# Altium project DSP_FPGA_BOTTOM.PrjPcb (part 2 of 2)

## Sheet Enconder_Part3.SchDoc
size A4
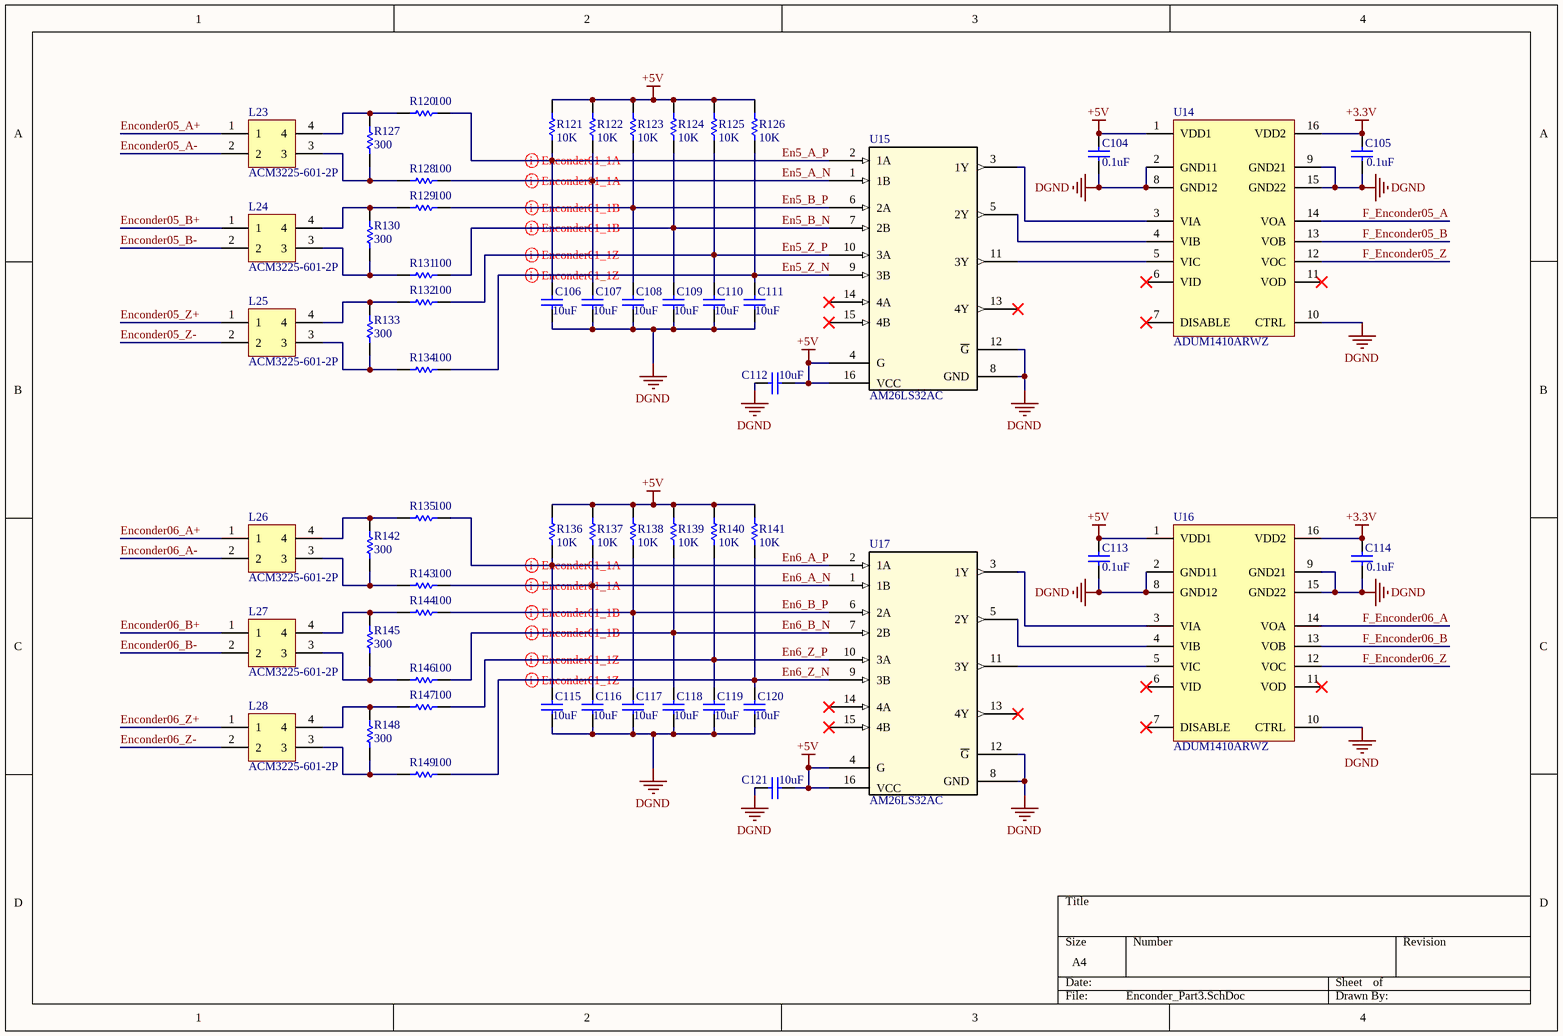
[diagram p10: Enconder_Part3.SchDoc]

### Parts
C104  value 0.1uF  [1608[0603]]  (hidden comment: Cap)
C105  value 0.1uF  [1608[0603]]  (hidden comment: Cap)
C106  value 10uF  [1608[0603]]  (hidden comment: Cap)
C107  value 10uF  [1608[0603]]  (hidden comment: Cap)
C108  value 10uF  [1608[0603]]  (hidden comment: Cap)
C109  value 10uF  [1608[0603]]  (hidden comment: Cap)
C110  value 10uF  [1608[0603]]  (hidden comment: Cap)
C111  value 10uF  [1608[0603]]  (hidden comment: Cap)
C112  value 10uF  [1608[0603]]  (hidden comment: Cap)
C113  value 0.1uF  [1608[0603]]  (hidden comment: Cap)
C114  value 0.1uF  [1608[0603]]  (hidden comment: Cap)
C115  value 10uF  [1608[0603]]  (hidden comment: Cap)
C116  value 10uF  [1608[0603]]  (hidden comment: Cap)
C117  value 10uF  [1608[0603]]  (hidden comment: Cap)
C118  value 10uF  [1608[0603]]  (hidden comment: Cap)
C119  value 10uF  [1608[0603]]  (hidden comment: Cap)
C120  value 10uF  [1608[0603]]  (hidden comment: Cap)
C121  value 10uF  [1608[0603]]  (hidden comment: Cap)
L23  ACM3225-601-2P  [ACM3225-601-2P]
L24  ACM3225-601-2P  [ACM3225-601-2P]
L25  ACM3225-601-2P  [ACM3225-601-2P]
L26  ACM3225-601-2P  [ACM3225-601-2P]
L27  ACM3225-601-2P  [ACM3225-601-2P]
L28  ACM3225-601-2P  [ACM3225-601-2P]
R120  value 100  [1608[0603]]  (hidden comment: Res1)
R121  value 10K  [1608[0603]]  (hidden comment: Res1)
R122  value 10K  [1608[0603]]  (hidden comment: Res1)
R123  value 10K  [1608[0603]]  (hidden comment: Res1)
R124  value 10K  [1608[0603]]  (hidden comment: Res1)
R125  value 10K  [1608[0603]]  (hidden comment: Res1)
R126  value 10K  [1608[0603]]  (hidden comment: Res1)
R127  value 300  [1608[0603]]  (hidden comment: Res1)
R128  value 100  [1608[0603]]  (hidden comment: Res1)
R129  value 100  [1608[0603]]  (hidden comment: Res1)
R130  value 300  [1608[0603]]  (hidden comment: Res1)
R131  value 100  [1608[0603]]  (hidden comment: Res1)
R132  value 100  [1608[0603]]  (hidden comment: Res1)
R133  value 300  [1608[0603]]  (hidden comment: Res1)
R134  value 100  [1608[0603]]  (hidden comment: Res1)
R135  value 100  [1608[0603]]  (hidden comment: Res1)
R136  value 10K  [1608[0603]]  (hidden comment: Res1)
R137  value 10K  [1608[0603]]  (hidden comment: Res1)
R138  value 10K  [1608[0603]]  (hidden comment: Res1)
R139  value 10K  [1608[0603]]  (hidden comment: Res1)
R140  value 10K  [1608[0603]]  (hidden comment: Res1)
R141  value 10K  [1608[0603]]  (hidden comment: Res1)
R142  value 300  [1608[0603]]  (hidden comment: Res1)
R143  value 100  [1608[0603]]  (hidden comment: Res1)
R144  value 100  [1608[0603]]  (hidden comment: Res1)
R145  value 300  [1608[0603]]  (hidden comment: Res1)
R146  value 100  [1608[0603]]  (hidden comment: Res1)
R147  value 100  [1608[0603]]  (hidden comment: Res1)
R148  value 300  [1608[0603]]  (hidden comment: Res1)
R149  value 100  [1608[0603]]  (hidden comment: Res1)
U14  ADUM1410ARWZ  [ADUM1410ARWZ_SOIC]
U15  AM26LS32AC  [AM26LS32AC_SOP]
U16  ADUM1410ARWZ  [ADUM1410ARWZ_SOIC]
U17  AM26LS32AC  [AM26LS32AC_SOP]

### Nets
+3.3V: C105.2 C114.2 U14.16(VDD2) U16.16(VDD2)
+5V: C104.2 C112.1 C113.2 C121.1 R121.2 R122.2 R123.2 R124.2 R125.2 R126.2 R136.2 R137.2 R138.2 R139.2 R140.2 R141.2 U14.1(VDD1) U15.4(G) U15.16(VCC) U16.1(VDD1) U17.4(G) U17.16(VCC)
DGND: C104.1 C105.1 C106.1 C107.1 C108.1 C109.1 C110.1 C111.1 C112.2 C113.1 C114.1 C115.1 C116.1 C117.1 C118.1 C119.1 C120.1 C121.2 U14.2(GND11) U14.8(GND12) U14.9(GND21) U14.10(CTRL) U14.15(GND22) U15.8(GND) U15.12(~{G}) U16.2(GND11) U16.8(GND12) U16.9(GND21) U16.10(CTRL) U16.15(GND22) U17.8(GND) U17.12(~{G})
En5_A_N: C107.2 R122.1 R128.2 U15.1(1B)
En5_A_P: C106.2 R120.2 R121.1 U15.2(1A)
En5_B_N: C109.2 R124.1 R131.2 U15.7(2B)
En5_B_P: C108.2 R123.1 R129.2 U15.6(2A)
En5_Z_N: C111.2 R126.1 R134.2 U15.9(3B)
En5_Z_P: C110.2 R125.1 R132.2 U15.10(3A)
En6_A_N: C116.2 R137.1 R143.2 U17.1(1B)
En6_A_P: C115.2 R135.2 R136.1 U17.2(1A)
En6_B_N: C118.2 R139.1 R146.2 U17.7(2B)
En6_B_P: C117.2 R138.1 R144.2 U17.6(2A)
En6_Z_N: C120.2 R141.1 R149.2 U17.9(3B)
En6_Z_P: C119.2 R140.1 R147.2 U17.10(3A)
Enconder05_A+: L23.1
Enconder05_A-: L23.2
Enconder05_B+: L24.1
Enconder05_B-: L24.2
Enconder05_Z+: L25.1
Enconder05_Z-: L25.2
Enconder06_A+: L26.1
Enconder06_A-: L26.2
Enconder06_B+: L27.1
Enconder06_B-: L27.2
Enconder06_Z+: L28.1
Enconder06_Z-: L28.2
F_Enconder05_A: U14.14(VOA)
F_Enconder05_B: U14.13(VOB)
F_Enconder05_Z: U14.12(VOC)
F_Enconder06_A: U16.14(VOA)
F_Enconder06_B: U16.13(VOB)
F_Enconder06_Z: U16.12(VOC)
NetL23_3: L23.3 R127.1 R128.1
NetL23_4: L23.4 R120.1 R127.2
NetL24_3: L24.3 R130.1 R131.1
NetL24_4: L24.4 R129.1 R130.2
NetL25_3: L25.3 R133.1 R134.1
NetL25_4: L25.4 R132.1 R133.2
NetL26_3: L26.3 R142.1 R143.1
NetL26_4: L26.4 R135.1 R142.2
NetL27_3: L27.3 R145.1 R146.1
NetL27_4: L27.4 R144.1 R145.2
NetL28_3: L28.3 R148.1 R149.1
NetL28_4: L28.4 R147.1 R148.2
NetU14_3: U14.3(VIA) U15.3(1Y)
NetU14_4: U14.4(VIB) U15.5(2Y)
NetU14_5: U14.5(VIC) U15.11(3Y)
NetU16_3: U16.3(VIA) U17.3(1Y)
NetU16_4: U16.4(VIB) U17.5(2Y)
NetU16_5: U16.5(VIC) U17.11(3Y)

Not connected (* = marked no-connect by the designer): U14 6(VID)* 7(DISABLE)* 11(VOD)*; U15 13(4Y)* 14(4A)* 15(4B)*; U16 6(VID)* 7(DISABLE)* 11(VOD)*; U17 13(4Y)* 14(4A)* 15(4B)*

### Layout directives
differential pair: En5_A_N, En5_A_P, En5_B_N, En5_B_P, En5_Z_N, En5_Z_P, En6_A_N, En6_A_P, En6_B_N, En6_B_P, En6_Z_N, En6_Z_P

### Library data of the parts
C104-C121 = Cap: Capacitor; Published: 8-Jun-2000; LatestRevisionDate: 17-Jul-2002; LatestRevisionNote: Re-released for DXP Platform.; PackageReference: RAD-0.3; Publisher: Altium Limited; PackageDescription: Radial Cap, Thru-Hole; 2 Leads; 0.3 in Pin Spacing
R120-R149 = Res1: Resistor; Published: 8-Jun-2000; LatestRevisionDate: 17-Jul-2002; LatestRevisionNote: Re-released for DXP Platform.; PackageReference: AXIAL-0.3; Publisher: Altium Limited; PackageDescription: Axial Device, Thru-Hole; 2 Leads; 0.3 in Pin Spacing

## Sheet FPGA_GPIO_Part1.SchDoc
size A4
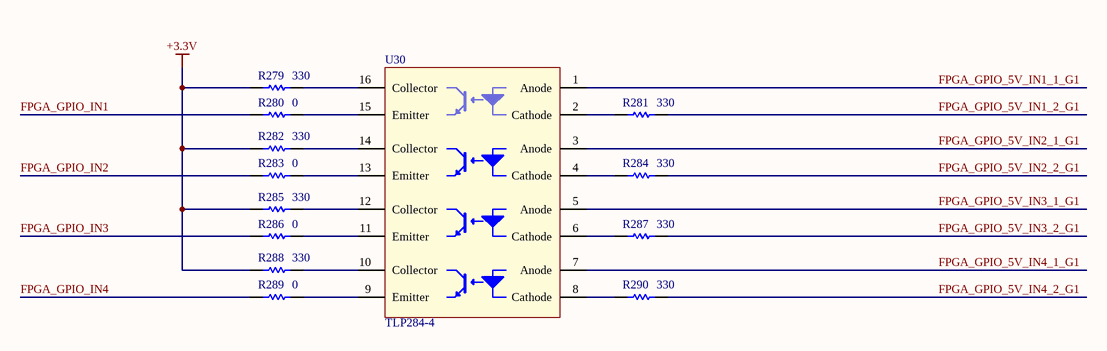
[diagram p11: FPGA_GPIO_Part1.SchDoc]

### Parts
R279  value 330  [1608[0603]]  (hidden comment: Res1)
R280  value 0  [1608[0603]]  (hidden comment: Res1)
R281  value 330  [1608[0603]]  (hidden comment: Res1)
R282  value 330  [1608[0603]]  (hidden comment: Res1)
R283  value 0  [1608[0603]]  (hidden comment: Res1)
R284  value 330  [1608[0603]]  (hidden comment: Res1)
R285  value 330  [1608[0603]]  (hidden comment: Res1)
R286  value 0  [1608[0603]]  (hidden comment: Res1)
R287  value 330  [1608[0603]]  (hidden comment: Res1)
R288  value 330  [1608[0603]]  (hidden comment: Res1)
R289  value 0  [1608[0603]]  (hidden comment: Res1)
R290  value 330  [1608[0603]]  (hidden comment: Res1)
U30  TLP284-4  [TLP284-4]

### Nets
+3.3V: R279.1 R282.1 R285.1 R288.1
FPGA_GPIO_5V_IN1_1_G1: U30.1(Anode)
FPGA_GPIO_5V_IN1_2_G1: R281.2
FPGA_GPIO_5V_IN2_1_G1: U30.3(Anode)
FPGA_GPIO_5V_IN2_2_G1: R284.2
FPGA_GPIO_5V_IN3_1_G1: U30.5(Anode)
FPGA_GPIO_5V_IN3_2_G1: R287.2
FPGA_GPIO_5V_IN4_1_G1: U30.7(Anode)
FPGA_GPIO_5V_IN4_2_G1: R290.2
FPGA_GPIO_IN1: R280.1
FPGA_GPIO_IN2: R283.1
FPGA_GPIO_IN3: R286.1
FPGA_GPIO_IN4: R289.1
NetR279_2: R279.2 U30.16(Collector)
NetR280_2: R280.2 U30.15(Emitter)
NetR281_1: R281.1 U30.2(Cathode)
NetR282_2: R282.2 U30.14(Collector)
NetR283_2: R283.2 U30.13(Emitter)
NetR284_1: R284.1 U30.4(Cathode)
NetR285_2: R285.2 U30.12(Collector)
NetR286_2: R286.2 U30.11(Emitter)
NetR287_1: R287.1 U30.6(Cathode)
NetR288_2: R288.2 U30.10(Collector)
NetR289_2: R289.2 U30.9(Emitter)
NetR290_1: R290.1 U30.8(Cathode)

### Library data of the parts
R279-R290 = Res1: Resistor; Published: 8-Jun-2000; LatestRevisionDate: 17-Jul-2002; LatestRevisionNote: Re-released for DXP Platform.; PackageReference: AXIAL-0.3; Publisher: Altium Limited; PackageDescription: Axial Device, Thru-Hole; 2 Leads; 0.3 in Pin Spacing

## Sheet Header.SchDoc
size A4
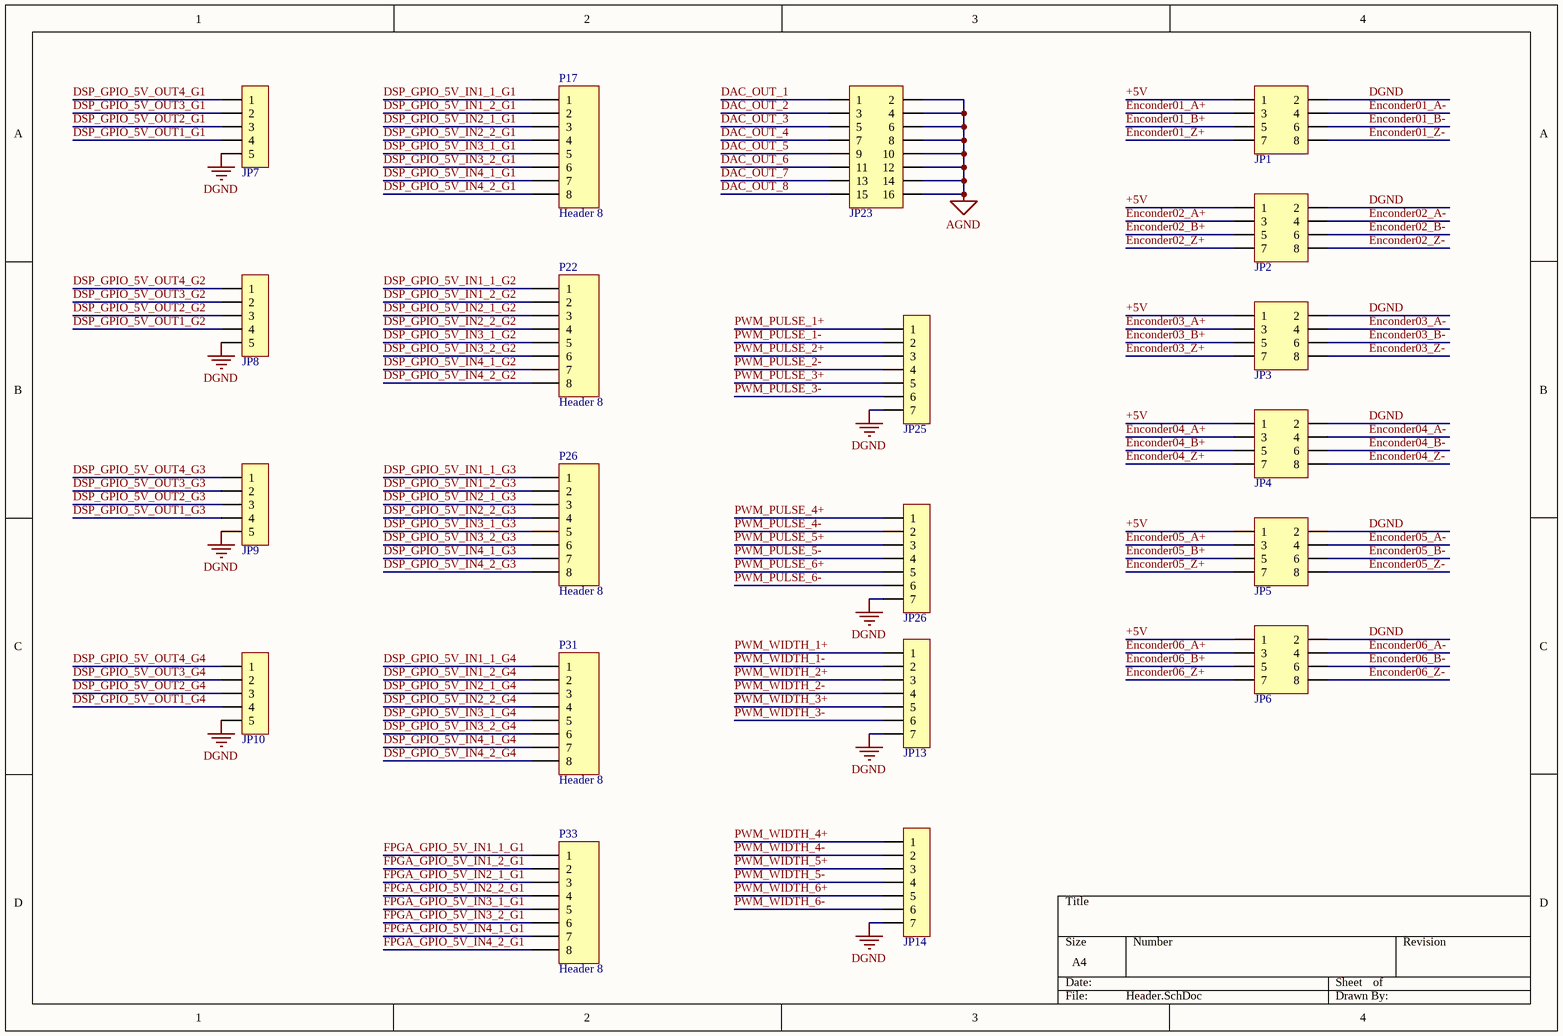
[diagram p12: Header.SchDoc]

### Parts
JP1  Header 4X2  [connector5569R]  (value not drawn)
JP2  Header 4X2  [connector5569R]  (value not drawn)
JP3  Header 4X2  [connector5569R]  (value not drawn)
JP4  Header 4X2  [connector5569R]  (value not drawn)
JP5  Header 4X2  [connector5569R]  (value not drawn)
JP6  Header 4X2  [connector5569R]  (value not drawn)
JP7  HDR-1X5  [ZH1.5-WI-5P]  (value not drawn)
JP8  HDR-1X5  [ZH1.5-WI-5P]  (value not drawn)
JP9  HDR-1X5  [ZH1.5-WI-5P]  (value not drawn)
JP10  HDR-1X5  [ZH1.5-WI-5P]  (value not drawn)
JP13  HDR-1X7  [XH2.54-WI-7P]  (value not drawn)
JP14  HDR-1X7  [XH2.54-WI-7P]  (value not drawn)
JP23  Header 8X2  [connector558916pin]  (value not drawn)
JP25  HDR-1X7  [XH2.54-WI-7P]  (value not drawn)
JP26  HDR-1X7  [XH2.54-WI-7P]  (value not drawn)
P17  Header 8  [connector5569R]
P22  Header 8  [connector5569R]
P26  Header 8  [connector5569R]
P31  Header 8  [connector5569R]
P33  Header 8  [connector5569R]

### Nets
+5V: JP1.1 JP2.1 JP3.1 JP4.1 JP5.1 JP6.1
AGND: JP23.2 JP23.4 JP23.6 JP23.8 JP23.10 JP23.12 JP23.14 JP23.16
DGND: JP1.2 JP2.2 JP3.2 JP4.2 JP5.2 JP6.2 JP7.5 JP8.5 JP9.5 JP10.5 JP13.7 JP14.7 JP25.7 JP26.7
DAC_OUT_1: JP23.1
DAC_OUT_2: JP23.3
DAC_OUT_3: JP23.5
DAC_OUT_4: JP23.7
DAC_OUT_5: JP23.9
DAC_OUT_6: JP23.11
DAC_OUT_7: JP23.13
DAC_OUT_8: JP23.15
DSP_GPIO_5V_IN1_1_G1: P17.1
DSP_GPIO_5V_IN1_1_G2: P22.1
DSP_GPIO_5V_IN1_1_G3: P26.1
DSP_GPIO_5V_IN1_1_G4: P31.1
DSP_GPIO_5V_IN1_2_G1: P17.2
DSP_GPIO_5V_IN1_2_G2: P22.2
DSP_GPIO_5V_IN1_2_G3: P26.2
DSP_GPIO_5V_IN1_2_G4: P31.2
DSP_GPIO_5V_IN2_1_G1: P17.3
DSP_GPIO_5V_IN2_1_G2: P22.3
DSP_GPIO_5V_IN2_1_G3: P26.3
DSP_GPIO_5V_IN2_1_G4: P31.3
DSP_GPIO_5V_IN2_2_G1: P17.4
DSP_GPIO_5V_IN2_2_G2: P22.4
DSP_GPIO_5V_IN2_2_G3: P26.4
DSP_GPIO_5V_IN2_2_G4: P31.4
DSP_GPIO_5V_IN3_1_G1: P17.5
DSP_GPIO_5V_IN3_1_G2: P22.5
DSP_GPIO_5V_IN3_1_G3: P26.5
DSP_GPIO_5V_IN3_1_G4: P31.5
DSP_GPIO_5V_IN3_2_G1: P17.6
DSP_GPIO_5V_IN3_2_G2: P22.6
DSP_GPIO_5V_IN3_2_G3: P26.6
DSP_GPIO_5V_IN3_2_G4: P31.6
DSP_GPIO_5V_IN4_1_G1: P17.7
DSP_GPIO_5V_IN4_1_G2: P22.7
DSP_GPIO_5V_IN4_1_G3: P26.7
DSP_GPIO_5V_IN4_1_G4: P31.7
DSP_GPIO_5V_IN4_2_G1: P17.8
DSP_GPIO_5V_IN4_2_G2: P22.8
DSP_GPIO_5V_IN4_2_G3: P26.8
DSP_GPIO_5V_IN4_2_G4: P31.8
DSP_GPIO_5V_OUT1_G1: JP7.4
DSP_GPIO_5V_OUT1_G2: JP8.4
DSP_GPIO_5V_OUT1_G3: JP9.4
DSP_GPIO_5V_OUT1_G4: JP10.4
DSP_GPIO_5V_OUT2_G1: JP7.3
DSP_GPIO_5V_OUT2_G2: JP8.3
DSP_GPIO_5V_OUT2_G3: JP9.3
DSP_GPIO_5V_OUT2_G4: JP10.3
DSP_GPIO_5V_OUT3_G1: JP7.2
DSP_GPIO_5V_OUT3_G2: JP8.2
DSP_GPIO_5V_OUT3_G3: JP9.2
DSP_GPIO_5V_OUT3_G4: JP10.2
DSP_GPIO_5V_OUT4_G1: JP7.1
DSP_GPIO_5V_OUT4_G2: JP8.1
DSP_GPIO_5V_OUT4_G3: JP9.1
DSP_GPIO_5V_OUT4_G4: JP10.1
Enconder01_A+: JP1.3
Enconder01_A-: JP1.4
Enconder01_B+: JP1.5
Enconder01_B-: JP1.6
Enconder01_Z+: JP1.7
Enconder01_Z-: JP1.8
Enconder02_A+: JP2.3
Enconder02_A-: JP2.4
Enconder02_B+: JP2.5
Enconder02_B-: JP2.6
Enconder02_Z+: JP2.7
Enconder02_Z-: JP2.8
Enconder03_A+: JP3.3
Enconder03_A-: JP3.4
Enconder03_B+: JP3.5
Enconder03_B-: JP3.6
Enconder03_Z+: JP3.7
Enconder03_Z-: JP3.8
Enconder04_A+: JP4.3
Enconder04_A-: JP4.4
Enconder04_B+: JP4.5
Enconder04_B-: JP4.6
Enconder04_Z+: JP4.7
Enconder04_Z-: JP4.8
Enconder05_A+: JP5.3
Enconder05_A-: JP5.4
Enconder05_B+: JP5.5
Enconder05_B-: JP5.6
Enconder05_Z+: JP5.7
Enconder05_Z-: JP5.8
Enconder06_A+: JP6.3
Enconder06_A-: JP6.4
Enconder06_B+: JP6.5
Enconder06_B-: JP6.6
Enconder06_Z+: JP6.7
Enconder06_Z-: JP6.8
FPGA_GPIO_5V_IN1_1_G1: P33.1
FPGA_GPIO_5V_IN1_2_G1: P33.2
FPGA_GPIO_5V_IN2_1_G1: P33.3
FPGA_GPIO_5V_IN2_2_G1: P33.4
FPGA_GPIO_5V_IN3_1_G1: P33.5
FPGA_GPIO_5V_IN3_2_G1: P33.6
FPGA_GPIO_5V_IN4_1_G1: P33.7
FPGA_GPIO_5V_IN4_2_G1: P33.8
PWM_PULSE_1+: JP25.1
PWM_PULSE_1-: JP25.2
PWM_PULSE_2+: JP25.3
PWM_PULSE_2-: JP25.4
PWM_PULSE_3+: JP25.5
PWM_PULSE_3-: JP25.6
PWM_PULSE_4+: JP26.1
PWM_PULSE_4-: JP26.2
PWM_PULSE_5+: JP26.3
PWM_PULSE_5-: JP26.4
PWM_PULSE_6+: JP26.5
PWM_PULSE_6-: JP26.6
PWM_WIDTH_1+: JP13.1
PWM_WIDTH_1-: JP13.2
PWM_WIDTH_2+: JP13.3
PWM_WIDTH_2-: JP13.4
PWM_WIDTH_3+: JP13.5
PWM_WIDTH_3-: JP13.6
PWM_WIDTH_4+: JP14.1
PWM_WIDTH_4-: JP14.2
PWM_WIDTH_5+: JP14.3
PWM_WIDTH_5-: JP14.4
PWM_WIDTH_6+: JP14.5
PWM_WIDTH_6-: JP14.6

### Library data of the parts
JP1-JP6 = Header 4X2: 4*2P接插件; 版权归属: 源创客; BOM名称: 4*2P接插件; 学习资源: www.ooocke.com
JP7-JP10 = Header 5: 5P接插件; 版权归属: 源创客; BOM名称: 5P接插件; 学习资源: www.ooocke.com
JP13 JP14 JP25 JP26 = Header 7: 7P接插件; 版权归属: 源创客; BOM名称: 7P接插件; 学习资源: www.ooocke.com
JP23 = Header 8X2: 8*2P接插件; 版权归属: 源创客; BOM名称: 8*2P接插件; 学习资源: www.ooocke.com
P17 P22 P26 P31 P33 = Header 8: Header, 8-Pin; LatestRevisionDate: 17-Jul-2002; LatestRevisionNote: Re-released for DXP Platform.; Publisher: Altium Limited

## Sheet Interface_DSP_FPGA.SchDoc
size A4
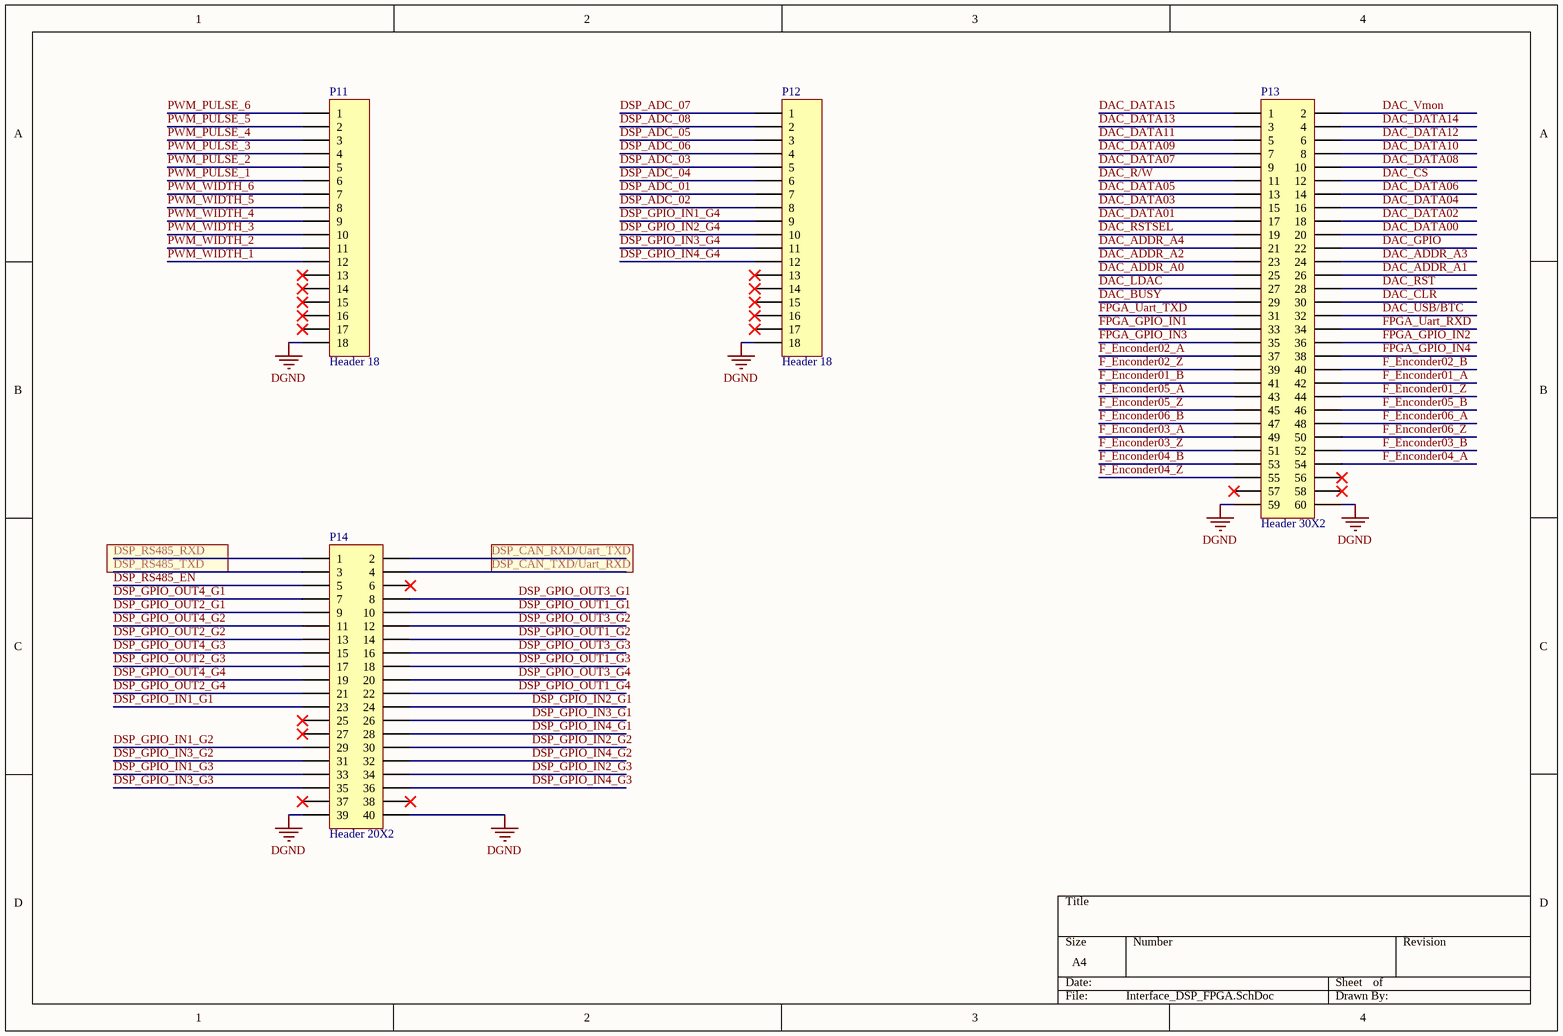
[diagram p13: Interface_DSP_FPGA.SchDoc]

### Parts
P11  Header 18  [HDR1X18]
P12  Header 18  [HDR1X18]
P13  Header 30X2  [HDR2X30]
P14  Header 20X2  [HDR2X20]

### Nets
DGND: P11.18 P12.18 P13.59 P13.60 P14.39 P14.40
DAC_ADDR_A0: P13.25  [project net A0]
DAC_ADDR_A1: P13.26  [project net A1]
DAC_ADDR_A2: P13.23  [project net A2]
DAC_ADDR_A3: P13.24  [project net A3]
DAC_ADDR_A4: P13.21  [project net A4]
DAC_BUSY: P13.29
DAC_CLR: P13.30
DAC_CS: P13.12
DAC_DATA00: P13.20  [project net D0]
DAC_DATA01: P13.17  [project net D1]
DAC_DATA02: P13.18  [project net D2]
DAC_DATA03: P13.15  [project net D3]
DAC_DATA04: P13.16  [project net D4]
DAC_DATA05: P13.13  [project net D5]
DAC_DATA06: P13.14  [project net D6]
DAC_DATA07: P13.9  [project net D7]
DAC_DATA08: P13.10  [project net D8]
DAC_DATA09: P13.7  [project net D9]
DAC_DATA10: P13.8  [project net D10]
DAC_DATA11: P13.5  [project net D11]
DAC_DATA12: P13.6  [project net D12]
DAC_DATA13: P13.3  [project net D13]
DAC_DATA14: P13.4  [project net D14]
DAC_DATA15: P13.1  [project net D15]
DAC_GPIO: P13.22
DAC_LDAC: P13.27
DAC_R/W: P13.11
DAC_RST: P13.28
DAC_RSTSEL: P13.19
DAC_USB/BTC: P13.32
DAC_Vmon: P13.2
DSP_ADC_01: P12.7
DSP_ADC_02: P12.8
DSP_ADC_03: P12.5
DSP_ADC_04: P12.6
DSP_ADC_05: P12.3
DSP_ADC_06: P12.4
DSP_ADC_07: P12.1
DSP_ADC_08: P12.2
DSP_CAN_RXD/Uart_TXD: P14.2  [project net CAN_P]
DSP_CAN_TXD/Uart_RXD: P14.4  [project net CAN_N]
DSP_GPIO_IN1_G1: P14.23
DSP_GPIO_IN1_G2: P14.29
DSP_GPIO_IN1_G3: P14.33
DSP_GPIO_IN1_G4: P12.9
DSP_GPIO_IN2_G1: P14.24
DSP_GPIO_IN2_G2: P14.30
DSP_GPIO_IN2_G3: P14.34
DSP_GPIO_IN2_G4: P12.10
DSP_GPIO_IN3_G1: P14.26
DSP_GPIO_IN3_G2: P14.31
DSP_GPIO_IN3_G3: P14.35
DSP_GPIO_IN3_G4: P12.11
DSP_GPIO_IN4_G1: P14.28
DSP_GPIO_IN4_G2: P14.32
DSP_GPIO_IN4_G3: P14.36
DSP_GPIO_IN4_G4: P12.12
DSP_GPIO_OUT1_G1: P14.10
DSP_GPIO_OUT1_G2: P14.14
DSP_GPIO_OUT1_G3: P14.18
DSP_GPIO_OUT1_G4: P14.22
DSP_GPIO_OUT2_G1: P14.9
DSP_GPIO_OUT2_G2: P14.13
DSP_GPIO_OUT2_G3: P14.17
DSP_GPIO_OUT2_G4: P14.21
DSP_GPIO_OUT3_G1: P14.8
DSP_GPIO_OUT3_G2: P14.12
DSP_GPIO_OUT3_G3: P14.16
DSP_GPIO_OUT3_G4: P14.20
DSP_GPIO_OUT4_G1: P14.7
DSP_GPIO_OUT4_G2: P14.11
DSP_GPIO_OUT4_G3: P14.15
DSP_GPIO_OUT4_G4: P14.19
DSP_RS485_EN: P14.5
DSP_RS485_RXD: P14.1
DSP_RS485_TXD: P14.3
F_Enconder01_A: P13.42
F_Enconder01_B: P13.41
F_Enconder01_Z: P13.44
F_Enconder02_A: P13.37
F_Enconder02_B: P13.40
F_Enconder02_Z: P13.39
F_Enconder03_A: P13.49
F_Enconder03_B: P13.52
F_Enconder03_Z: P13.51
F_Enconder04_A: P13.54
F_Enconder04_B: P13.53
F_Enconder04_Z: P13.55
F_Enconder05_A: P13.43
F_Enconder05_B: P13.46
F_Enconder05_Z: P13.45
F_Enconder06_A: P13.48
F_Enconder06_B: P13.47
F_Enconder06_Z: P13.50
FPGA_GPIO_IN1: P13.33
FPGA_GPIO_IN2: P13.36
FPGA_GPIO_IN3: P13.35
FPGA_GPIO_IN4: P13.38
FPGA_Uart_RXD: P13.34
FPGA_Uart_TXD: P13.31
PWM_PULSE_1: P11.6
PWM_PULSE_2: P11.5
PWM_PULSE_3: P11.4
PWM_PULSE_4: P11.3
PWM_PULSE_5: P11.2
PWM_PULSE_6: P11.1
PWM_WIDTH_1: P11.12
PWM_WIDTH_2: P11.11
PWM_WIDTH_3: P11.10
PWM_WIDTH_4: P11.9
PWM_WIDTH_5: P11.8
PWM_WIDTH_6: P11.7

Not connected (* = marked no-connect by the designer): P11 13* 14* 15* 16* 17*; P12 13* 14* 15* 16* 17*; P13 56* 57* 58*; P14 6* 25* 27* 37* 38*

### Library data of the parts
P11 P12 = Header 18: Header, 18-Pin; LatestRevisionDate: 17-Jul-2002; LatestRevisionNote: Re-released for DXP Platform.; Publisher: Altium Limited
P13 = Header 30X2: Header, 30-Pin, Dual row; LatestRevisionDate: 17-Jul-2002; LatestRevisionNote: Re-released for DXP Platform.; Publisher: Altium Limited
P14 = Header 20X2: Header, 20-Pin, Dual row; LatestRevisionDate: 17-Jul-2002; LatestRevisionNote: Re-released for DXP Platform.; Publisher: Altium Limited

## Sheet Power.SchDoc
size A4
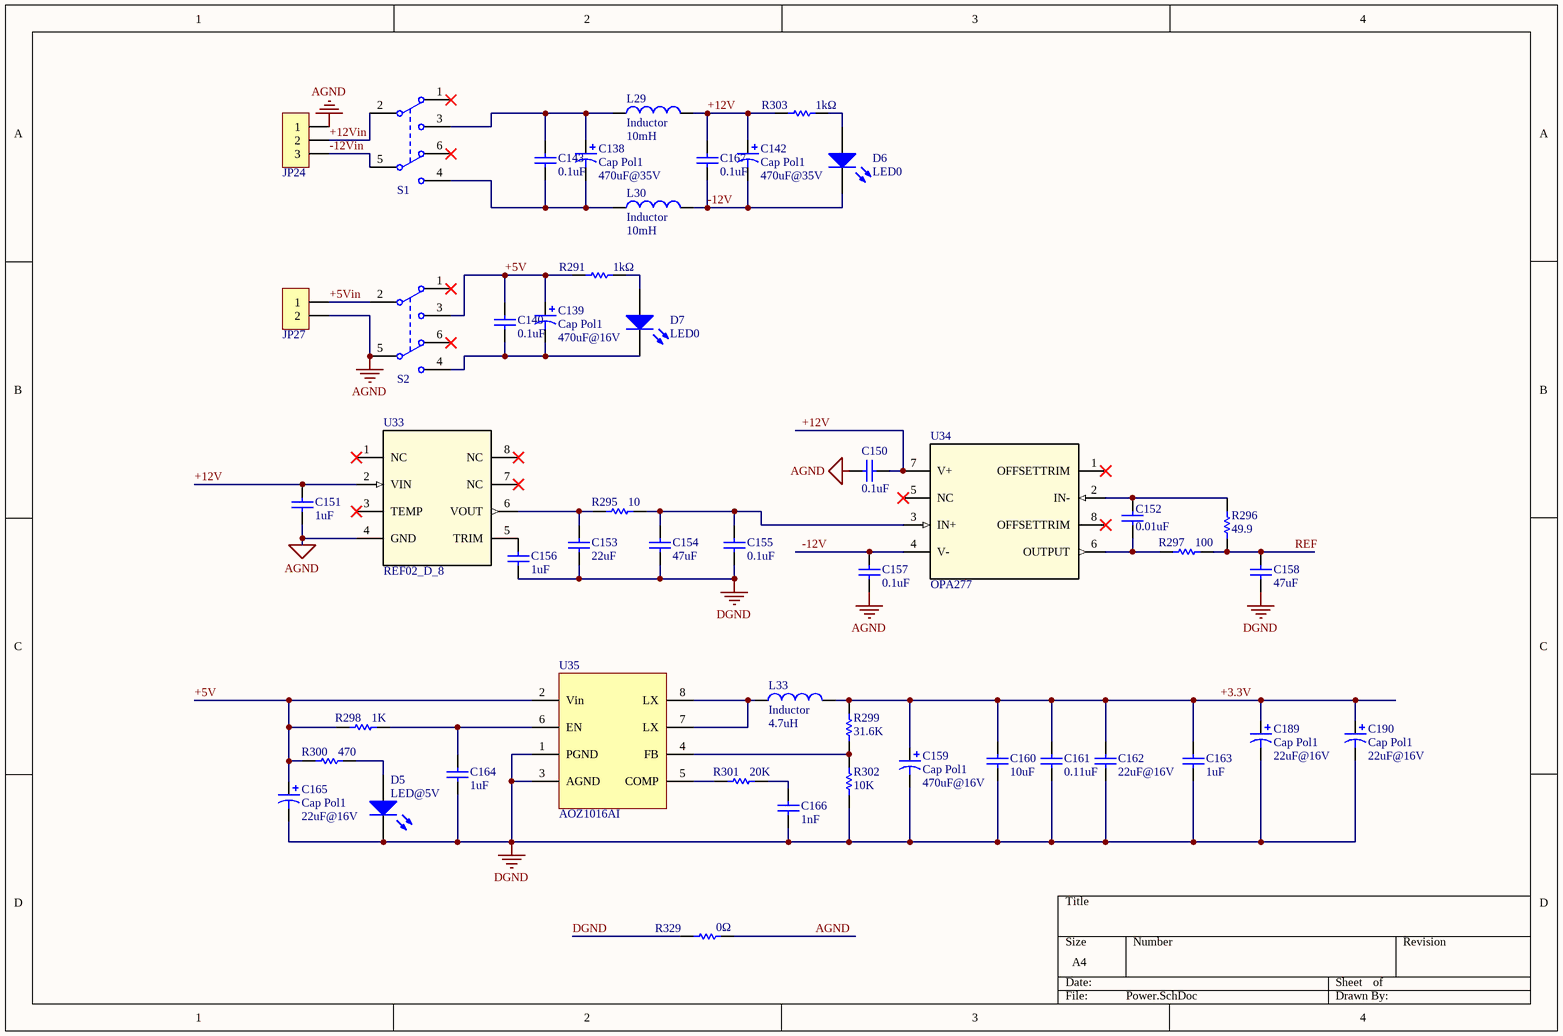
[diagram p14: Power.SchDoc]

### Parts
C138  Cap Pol1  value 470uF@35V  [RB7.6-15]
C139  Cap Pol1  value 470uF@16V  [RB7.6-15]
C140  value 0.1uF  [1608[0603]]  (hidden comment: Cap)
C142  Cap Pol1  value 470uF@35V  [RB7.6-15]
C143  value 0.1uF  [1608[0603]]  (hidden comment: Cap)
C150  value 0.1uF  [1608[0603]]  (hidden comment: Cap)
C151  value 1uF  [1608[0603]]  (hidden comment: Cap)
C152  value 0.01uF  [1608[0603]]  (hidden comment: Cap)
C153  value 22uF  [C0805]  (hidden comment: Cap)
C154  value 47uF  [C1206]  (hidden comment: Cap)
C155  value 0.1uF  [1608[0603]]  (hidden comment: Cap)
C156  value 1uF  [1608[0603]]  (hidden comment: Cap)
C157  value 0.1uF  [1608[0603]]  (hidden comment: Cap)
C158  value 47uF  [C1206]  (hidden comment: Cap)
C159  Cap Pol1  value 470uF@16V  [RB7.6-15]
C160  value 10uF  [1608[0603]]  (hidden comment: Cap)
C161  value 0.11uF  [1608[0603]]  (hidden comment: Cap)
C162  value 22uF@16V  [C0805]  (hidden comment: Cap)
C163  value 1uF  [1608[0603]]  (hidden comment: Cap)
C164  value 1uF  [1608[0603]]  (hidden comment: Cap)
C165  Cap Pol1  value 22uF@16V  [RB5-10.5]
C166  value 1nF  [1608[0603]]  (hidden comment: Cap)
C167  value 0.1uF  [1608[0603]]  (hidden comment: Cap)
C189  Cap Pol1  value 22uF@16V  [RB5-10.5]
C190  Cap Pol1  value 22uF@16V  [RB5-10.5]
D5  LED@5V  [LED-1]
D6  LED0  [LED-0]
D7  LED0  [LED-0]
JP24  HDR-1X3  [KF128-3.81-3P]  (value not drawn)
JP27  HDR-1X2  [KF128-3.81-2P]  (value not drawn)
L29  Inductor  value 10mH  [0402-A]
L30  Inductor  value 10mH  [0402-A]
L33  Inductor  value 4.7uH  [2029]
R291  value 1kΩ  [14-1210]  (hidden comment: Res1)
R295  value 10  [1608[0603]]  (hidden comment: Res1)
R296  value 49.9  [1608[0603]]  (hidden comment: Res1)
R297  value 100  [1608[0603]]  (hidden comment: Res1)
R298  value 1K  [1608[0603]]  (hidden comment: Res1)
R299  value 31.6K  [1608[0603]]  (hidden comment: Res1)
R300  value 470  [1608[0603]]  (hidden comment: Res1)
R301  value 20K  [1608[0603]]  (hidden comment: Res1)
R302  value 10K  [1608[0603]]  (hidden comment: Res1)
R303  value 1kΩ  [14-1210]  (hidden comment: Res1)
R329  value 0Ω  [C2512]  (hidden comment: Res1)
S1  SK-22D02  [SK-22D02]  (value not drawn)
S2  SK-22D02  [SK-22D02]  (value not drawn)
U33  REF02_D_8  [REF02_D_8]
U34  OPA277  [OPA277]
U35  AOZ1016AI  [AOZ1016AI]

### Nets
+3.3V: C159.1 C160.2 C161.2 C162.2 C163.2 C189.1 C190.1 L33.2 R299.1
+5V: C139.1 C140.2 C165.1 R291.1 R298.2 R300.2 S2.3 U35.2(Vin)
AGND: C150.1 C151.1 C157.1 JP24.1 JP27.2 R329.1 S2.5 U33.4(GND)
DGND: C153.1 C154.1 C155.1 C156.1 C158.1 C159.2 C160.1 C161.1 C162.1 C163.1 C164.1 C165.2 C166.1 C189.2 C190.2 D5.2(K) R302.2 R329.2 U35.1(PGND) U35.3(AGND)
REF: C158.2 R296.1 R297.1
+5Vin: JP27.1 S2.2
+12V: C142.1 C150.2 C151.2 C167.2 L29.2 R303.1 U33.2(VIN) U34.7(V+)
+12Vin: JP24.2 S1.2
-12V: C142.2 C157.2 C167.1 D6.2(K) L30.2 U34.4(V-)
-12Vin: JP24.3 S1.5
NetC138_1: C138.1 C143.2 L29.1 S1.3
NetC138_2: C138.2 C143.1 L30.1 S1.4
NetC139_2: C139.2 C140.1 D7.2(K) S2.4
NetC152_1: C152.1 R297.2 U34.6(OUTPUT)
NetC152_2: C152.2 R296.2 U34.2(IN-)
NetC153_2: C153.2 R295.2 U33.6(VOUT)
NetC154_2: C154.2 C155.2 R295.1 U34.3(IN+)
NetC156_2: C156.2 U33.5(TRIM)
NetC164_2: C164.2 R298.1 U35.6(EN)
NetC166_2: C166.2 R301.1
NetD5_1: D5.1(A) R300.1
NetD6_1: D6.1(A) R303.2
NetD7_1: D7.1(A) R291.2
NetL33_1: L33.1 U35.7(LX) U35.8(LX)
NetR299_2: R299.2 R302.1 U35.4(FB)
NetR301_2: R301.2 U35.5(COMP)

Not connected (* = marked no-connect by the designer): S1 1* 6*; S2 1* 6*; U33 1(NC)* 3(TEMP)* 7(NC)* 8(NC)*; U34 1(OFFSETTRIM)* 5(NC)* 8(OFFSETTRIM)*

### Library data of the parts
C138 C139 C142 C159 C165 C189 C190 = Cap Pol1: Polarized Capacitor (Radial); Published: 8-Jun-2000; LatestRevisionDate: 17-Jul-2002; LatestRevisionNote: Re-released for DXP Platform.; PackageReference: RB7.6-15; Publisher: Altium Limited; PackageDescription: Polarized Capacitor (Radial); 2 Leads
C140 C143 C150-C158 C160-C164 C166 C167 = Cap: Capacitor; Published: 8-Jun-2000; LatestRevisionDate: 17-Jul-2002; LatestRevisionNote: Re-released for DXP Platform.; PackageReference: RAD-0.3; Publisher: Altium Limited; PackageDescription: Radial Cap, Thru-Hole; 2 Leads; 0.3 in Pin Spacing
D5 = LED3: Typical BLUE SiC LED; Published: 8-Jun-2000; LatestRevisionDate: 17-Dec-2003; LatestRevisionNote: PCB Footprint replaced.; DatasheetVersion: 16-Apr-2002; PackageVersion: 16-Apr-2002; PackageReference: 3.5X2.8X1.9; Publisher: Altium Limited; PackageDescription: SM LED; 2 C-Bend Leads; Body 3.5 x 2.8 x 1.9 mm, inc leads (LxWxH typ)
D6 D7 = LED0: Typical INFRARED GaAs LED; Published: 8-Jun-2000; LatestRevisionDate: 08-Jul-2005; LatestRevisionNote: Mech Layer 1 removed.; PackageReference: LED-0; Publisher: Altium Limited; PackageDescription: LED; 2 Leads
JP24 = Header 3: 3P接插件; 版权归属: 源创客; BOM名称: 3P接插件; 学习资源: www.ooocke.com
JP27 = Header 2: 2P接插件; 版权归属: 源创客; BOM名称: 2P接插件; 学习资源: www.ooocke.com
L29 L30 L33 = Inductor: Code_IEC: 1005; Published: 8-Jun-2000; LatestRevisionDate: 29-May-2009; LatestRevisionNote: IPC-7351 Footprint Added.; PackageReference: 0402-A; Publisher: Altium Limited; PackageDescription: Chip Inductor; Code_JEITA: 0402
R291 R295-R303 R329 = Res1: Resistor; Published: 8-Jun-2000; LatestRevisionDate: 17-Jul-2002; LatestRevisionNote: Re-released for DXP Platform.; PackageReference: AXIAL-0.3; Publisher: Altium Limited; PackageDescription: Axial Device, Thru-Hole; 2 Leads; 0.3 in Pin Spacing
S1 S2 = SSW-2P: 2路波动开关; BOM名称: 波动开关; 版权归属: 源创客; 学习资源: www.ooocke.com
U33 = REF02_D_8: Manufacturer: Texas Instruments; GENERIC_PART_NUMBER: REF02; INDUSTRY_STD_PKG_TYPE: SOIC; FAMILY_NAME: SERIES VOLTAGE REFERENCE; PIN_COUNT: 8; PACKAGE_DESIGNATOR: D; Datasheet_URL: http://www.ti.com/lit/gpn/REF02; Vendor: Texas Instruments; Manufacturer_Part_Number: ref02_d_8; Value: Value; Type: Type; RefDes: RefDes
U34 = OPA277: Manufacturer: Texas Instruments; Manufacturer_Part_Number: opa277_d_8; INDUSTRY_STD_PKG_TYPE: SOIC; FAMILY_NAME: LOW OFFSET VOLTAGE; PIN_COUNT: 8; PACKAGE_DESIGNATOR: D; Datasheet_URL: http://www.ti.com/lit/gpn/OPA277; GENERIC_PART_NUMBER: OPA277; Vendor: Texas Instruments; Value: Value; Type: Type; RefDes: RefDes

## Sheet PWM_PULSE.SchDoc
size A4
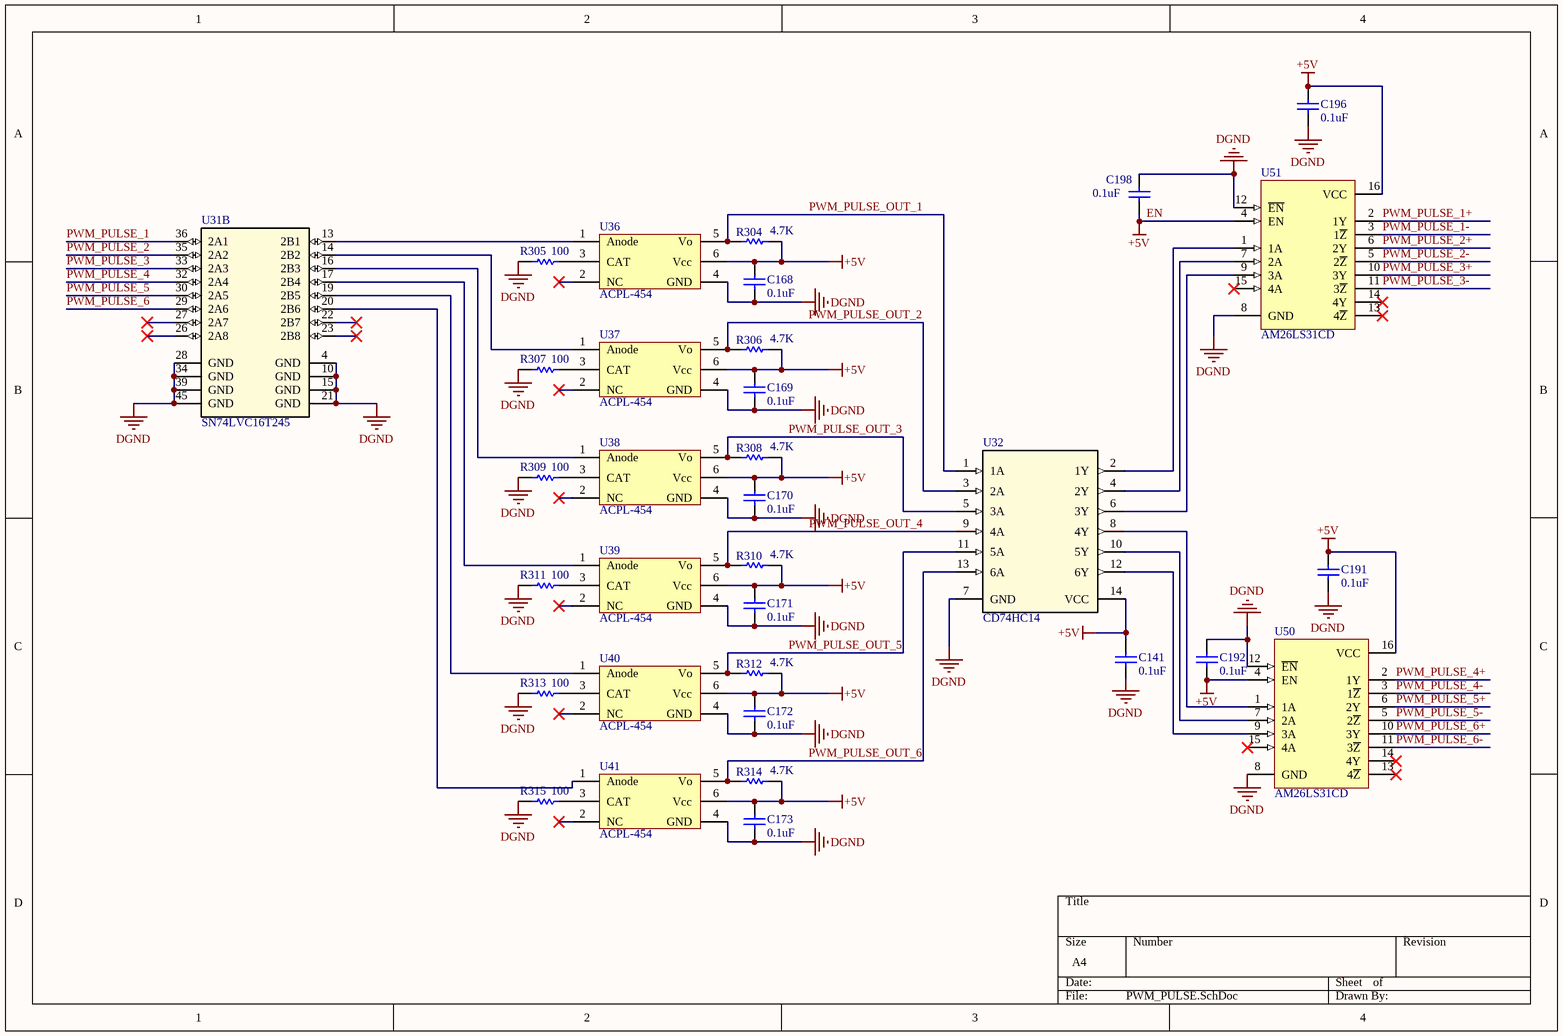
[diagram p15: PWM_PULSE.SchDoc]

### Parts
C141  value 0.1uF  [1608[0603]]  (hidden comment: Cap)
C168  value 0.1uF  [1608[0603]]  (hidden comment: Cap)
C169  value 0.1uF  [1608[0603]]  (hidden comment: Cap)
C170  value 0.1uF  [1608[0603]]  (hidden comment: Cap)
C171  value 0.1uF  [1608[0603]]  (hidden comment: Cap)
C172  value 0.1uF  [1608[0603]]  (hidden comment: Cap)
C173  value 0.1uF  [1608[0603]]  (hidden comment: Cap)
C191  value 0.1uF  [1608[0603]]  (hidden comment: Cap)
C192  value 0.1uF  [1608[0603]]  (hidden comment: Cap)
C196  value 0.1uF  [1608[0603]]  (hidden comment: Cap)
C198  value 0.1uF  [1608[0603]]  (hidden comment: Cap)
R304  value 4.7K  [1608[0603]]  (hidden comment: Res1)
R305  value 100  [1608[0603]]  (hidden comment: Res1)
R306  value 4.7K  [1608[0603]]  (hidden comment: Res1)
R307  value 100  [1608[0603]]  (hidden comment: Res1)
R308  value 4.7K  [1608[0603]]  (hidden comment: Res1)
R309  value 100  [1608[0603]]  (hidden comment: Res1)
R310  value 4.7K  [1608[0603]]  (hidden comment: Res1)
R311  value 100  [1608[0603]]  (hidden comment: Res1)
R312  value 4.7K  [1608[0603]]  (hidden comment: Res1)
R313  value 100  [1608[0603]]  (hidden comment: Res1)
R314  value 4.7K  [1608[0603]]  (hidden comment: Res1)
R315  value 100  [1608[0603]]  (hidden comment: Res1)
U31  SN74LVC16T245  [SN74LVC16T245_TSSOP]  (part B of 2)
U32  CD74HC14  [CD74HC14_SOIC]
U36  ACPL-454  [ACPL-P454]
U37  ACPL-454  [ACPL-P454]
U38  ACPL-454  [ACPL-P454]
U39  ACPL-454  [ACPL-P454]
U40  ACPL-454  [ACPL-P454]
U41  ACPL-454  [ACPL-P454]
U50  AM26LS31CD  [D016_N]
U51  AM26LS31CD  [D016_N]

### Nets
+5V: C141.2 C168.2 C169.2 C170.2 C171.2 C172.2 C173.2 C191.2 C192.1 C196.2 C198.1 R304.1 R306.1 R308.1 R310.1 R312.1 R314.1 U32.14(VCC) U36.6(Vcc) U37.6(Vcc) U38.6(Vcc) U39.6(Vcc) U40.6(Vcc) U41.6(Vcc) U50.4(EN) U50.16(VCC) U51.4(EN) U51.16(VCC)  [also labelled EN]
DGND: C141.1 C168.1 C169.1 C170.1 C171.1 C172.1 C173.1 C191.1 C192.2 C196.1 C198.2 R305.2 R307.2 R309.2 R311.2 R313.2 R315.2 U31.4(GND) U31.10(GND) U31.15(GND) U31.21(GND) U31.28(GND) U31.34(GND) U31.39(GND) U31.45(GND) U32.7(GND) U36.4(GND) U37.4(GND) U38.4(GND) U39.4(GND) U40.4(GND) U41.4(GND) U50.8(GND) U50.12(~{EN}) U51.8(GND) U51.12(~{EN})
PWM_PULSE_1: U31.36(2A1)
PWM_PULSE_1+: U51.2(1Y)
PWM_PULSE_1-: U51.3(1~{Z})
PWM_PULSE_2: U31.35(2A2)
PWM_PULSE_2+: U51.6(2Y)
PWM_PULSE_2-: U51.5(2~{Z})
PWM_PULSE_3: U31.33(2A3)
PWM_PULSE_3+: U51.10(3Y)
PWM_PULSE_3-: U51.11(3~{Z})
PWM_PULSE_4: U31.32(2A4)
PWM_PULSE_4+: U50.2(1Y)
PWM_PULSE_4-: U50.3(1~{Z})
PWM_PULSE_5: U31.30(2A5)
PWM_PULSE_5+: U50.6(2Y)
PWM_PULSE_5-: U50.5(2~{Z})
PWM_PULSE_6: U31.29(2A6)
PWM_PULSE_6+: U50.10(3Y)
PWM_PULSE_6-: U50.11(3~{Z})
PWM_PULSE_OUT_1: R304.2 U32.1(1A) U36.5(Vo)
PWM_PULSE_OUT_2: R306.2 U32.3(2A) U37.5(Vo)
PWM_PULSE_OUT_3: R308.2 U32.5(3A) U38.5(Vo)
PWM_PULSE_OUT_4: R310.2 U32.9(4A) U39.5(Vo)
PWM_PULSE_OUT_5: R312.2 U32.11(5A) U40.5(Vo)
PWM_PULSE_OUT_6: R314.2 U32.13(6A) U41.5(Vo)
NetR305_1: R305.1 U36.3(CAT)
NetR307_1: R307.1 U37.3(CAT)
NetR309_1: R309.1 U38.3(CAT)
NetR311_1: R311.1 U39.3(CAT)
NetR313_1: R313.1 U40.3(CAT)
NetR315_1: R315.1 U41.3(CAT)
NetU31_13: U31.13(2B1) U36.1(Anode)
NetU31_14: U31.14(2B2) U37.1(Anode)
NetU31_16: U31.16(2B3) U38.1(Anode)
NetU31_17: U31.17(2B4) U39.1(Anode)
NetU31_19: U31.19(2B5) U40.1(Anode)
NetU31_20: U31.20(2B6) U41.1(Anode)
NetU32_2: U32.2(1Y) U51.1(1A)
NetU32_4: U32.4(2Y) U51.7(2A)
NetU32_6: U32.6(3Y) U51.9(3A)
NetU32_8: U32.8(4Y) U50.1(1A)
NetU32_10: U32.10(5Y) U50.7(2A)
NetU32_12: U32.12(6Y) U50.9(3A)

Not connected (* = marked no-connect by the designer): U31 22(2B7)* 23(2B8)* 26(2A8)* 27(2A7)*; U36 2(NC)*; U37 2(NC)*; U38 2(NC)*; U39 2(NC)*; U40 2(NC)*; U41 2(NC)*; U50 13(4~{Z})* 14(4Y)* 15(4A)*; U51 13(4~{Z})* 14(4Y)* 15(4A)*

### Library data of the parts
C141 C168-C173 C191 C192 C196 C198 = Cap: Capacitor; Published: 8-Jun-2000; LatestRevisionDate: 17-Jul-2002; LatestRevisionNote: Re-released for DXP Platform.; PackageReference: RAD-0.3; Publisher: Altium Limited; PackageDescription: Radial Cap, Thru-Hole; 2 Leads; 0.3 in Pin Spacing
R304-R315 = Res1: Resistor; Published: 8-Jun-2000; LatestRevisionDate: 17-Jul-2002; LatestRevisionNote: Re-released for DXP Platform.; PackageReference: AXIAL-0.3; Publisher: Altium Limited; PackageDescription: Axial Device, Thru-Hole; 2 Leads; 0.3 in Pin Spacing
U31 = SN74LVC16T245_A
U32 = CD74HC14: Manufacturer: Texas Instruments; INDUSTRY_STD_PKG_TYPE: SOIC; FAMILY_NAME: INVERTING BUFFER/DRIVER; PIN_COUNT: 14; PACKAGE_DESIGNATOR: D; Datasheet_URL: http://www.ti.com/lit/gpn/CD74HC14; GENERIC_PART_NUMBER: CD74HC14; Value: Value; Type: Type; RefDes: RefDes
U50 U51 = AM26LS31CD: Quadruple Differential Line Driver; Published: 15-May-2002; LatestRevisionDate: 13-Apr-2006; LatestRevisionNote: IPC-7351 Footprint Added.; DatasheetVersion: May-1990; PackageVersion: Jan-1998; PackageReference: D016; Publisher: Altium Limited; PackageDescription: 16-Pin Small Outline Integrated Circuit 1.27 mm Pitch; Code_IPC: SOIC127P600-16; ComponentLink1Description: Manufacturer Link; ComponentLink1URL: http://www.ti.com/; ComponentLink2Description: Datasheet; ComponentLink2URL: http://www-s.ti.com/sc/ds/am26ls31.pdf

## Sheet PWM_WIDTH.SchDoc
size A4
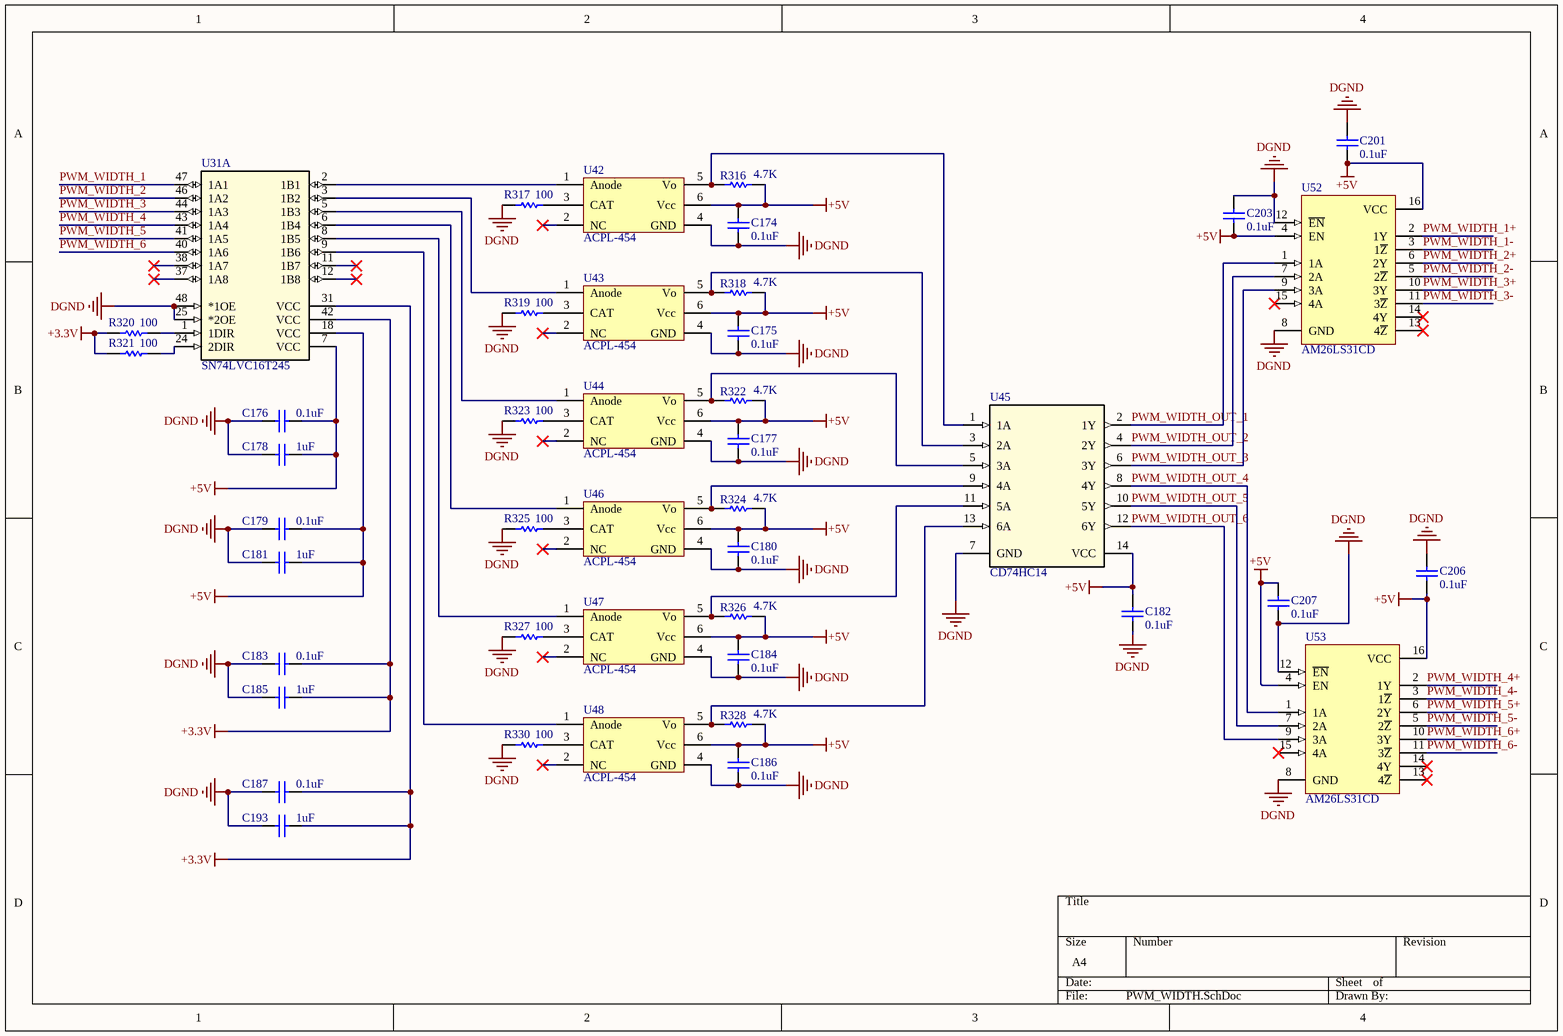
[diagram p16: PWM_WIDTH.SchDoc]

### Parts
C174  value 0.1uF  [1608[0603]]  (hidden comment: Cap)
C175  value 0.1uF  [1608[0603]]  (hidden comment: Cap)
C176  value 0.1uF  [1608[0603]]  (hidden comment: Cap)
C177  value 0.1uF  [1608[0603]]  (hidden comment: Cap)
C178  value 1uF  [1608[0603]]  (hidden comment: Cap)
C179  value 0.1uF  [1608[0603]]  (hidden comment: Cap)
C180  value 0.1uF  [1608[0603]]  (hidden comment: Cap)
C181  value 1uF  [1608[0603]]  (hidden comment: Cap)
C182  value 0.1uF  [1608[0603]]  (hidden comment: Cap)
C183  value 0.1uF  [1608[0603]]  (hidden comment: Cap)
C184  value 0.1uF  [1608[0603]]  (hidden comment: Cap)
C185  value 1uF  [1608[0603]]  (hidden comment: Cap)
C186  value 0.1uF  [1608[0603]]  (hidden comment: Cap)
C187  value 0.1uF  [1608[0603]]  (hidden comment: Cap)
C193  value 1uF  [1608[0603]]  (hidden comment: Cap)
C201  value 0.1uF  [1608[0603]]  (hidden comment: Cap)
C203  value 0.1uF  [1608[0603]]  (hidden comment: Cap)
C206  value 0.1uF  [1608[0603]]  (hidden comment: Cap)
C207  value 0.1uF  [1608[0603]]  (hidden comment: Cap)
R316  value 4.7K  [1608[0603]]  (hidden comment: Res1)
R317  value 100  [1608[0603]]  (hidden comment: Res1)
R318  value 4.7K  [1608[0603]]  (hidden comment: Res1)
R319  value 100  [1608[0603]]  (hidden comment: Res1)
R320  value 100  [1608[0603]]  (hidden comment: Res1)
R321  value 100  [1608[0603]]  (hidden comment: Res1)
R322  value 4.7K  [1608[0603]]  (hidden comment: Res1)
R323  value 100  [1608[0603]]  (hidden comment: Res1)
R324  value 4.7K  [1608[0603]]  (hidden comment: Res1)
R325  value 100  [1608[0603]]  (hidden comment: Res1)
R326  value 4.7K  [1608[0603]]  (hidden comment: Res1)
R327  value 100  [1608[0603]]  (hidden comment: Res1)
R328  value 4.7K  [1608[0603]]  (hidden comment: Res1)
R330  value 100  [1608[0603]]  (hidden comment: Res1)
U31  SN74LVC16T245  [SN74LVC16T245_TSSOP]  (part A of 2)
U42  ACPL-454  [ACPL-P454]
U43  ACPL-454  [ACPL-P454]
U44  ACPL-454  [ACPL-P454]
U45  CD74HC14  [CD74HC14_SOIC]
U46  ACPL-454  [ACPL-P454]
U47  ACPL-454  [ACPL-P454]
U48  ACPL-454  [ACPL-P454]
U52  AM26LS31CD  [D016_N]
U53  AM26LS31CD  [D016_N]

### Nets
+3.3V: C183.1 C185.1 C187.1 C193.1 R320.2 R321.2 U31.31(VCC) U31.42(VCC)
+5V: C174.2 C175.2 C176.1 C177.2 C178.1 C179.1 C180.2 C181.1 C182.2 C184.2 C186.2 C201.2 C203.1 C206.1 C207.2 R316.1 R318.1 R322.1 R324.1 R326.1 R328.1 U31.7(VCC) U31.18(VCC) U42.6(Vcc) U43.6(Vcc) U44.6(Vcc) U45.14(VCC) U46.6(Vcc) U47.6(Vcc) U48.6(Vcc) U52.4(EN) U52.16(VCC) U53.4(EN) U53.16(VCC)
DGND: C174.1 C175.1 C176.2 C177.1 C178.2 C179.2 C180.1 C181.2 C182.1 C183.2 C184.1 C185.2 C186.1 C187.2 C193.2 C201.1 C203.2 C206.2 C207.1 R317.2 R319.2 R323.2 R325.2 R327.2 R330.2 U31.25(*2OE) U31.48(*1OE) U42.4(GND) U43.4(GND) U44.4(GND) U45.7(GND) U46.4(GND) U47.4(GND) U48.4(GND) U52.8(GND) U52.12(~{EN}) U53.8(GND) U53.12(~{EN})
PWM_WIDTH_1: U31.47(1A1)
PWM_WIDTH_1+: U52.2(1Y)
PWM_WIDTH_1-: U52.3(1~{Z})
PWM_WIDTH_2: U31.46(1A2)
PWM_WIDTH_2+: U52.6(2Y)
PWM_WIDTH_2-: U52.5(2~{Z})
PWM_WIDTH_3: U31.44(1A3)
PWM_WIDTH_3+: U52.10(3Y)
PWM_WIDTH_3-: U52.11(3~{Z})
PWM_WIDTH_4: U31.43(1A4)
PWM_WIDTH_4+: U53.2(1Y)
PWM_WIDTH_4-: U53.3(1~{Z})
PWM_WIDTH_5: U31.41(1A5)
PWM_WIDTH_5+: U53.6(2Y)
PWM_WIDTH_5-: U53.5(2~{Z})
PWM_WIDTH_6: U31.40(1A6)
PWM_WIDTH_6+: U53.10(3Y)
PWM_WIDTH_6-: U53.11(3~{Z})
PWM_WIDTH_OUT_1: U45.2(1Y) U52.1(1A)
PWM_WIDTH_OUT_2: U45.4(2Y) U52.7(2A)
PWM_WIDTH_OUT_3: U45.6(3Y) U52.9(3A)
PWM_WIDTH_OUT_4: U45.8(4Y) U53.1(1A)
PWM_WIDTH_OUT_5: U45.10(5Y) U53.7(2A)
PWM_WIDTH_OUT_6: U45.12(6Y) U53.9(3A)
NetR316_2: R316.2 U42.5(Vo) U45.1(1A)
NetR317_1: R317.1 U42.3(CAT)
NetR318_2: R318.2 U43.5(Vo) U45.3(2A)
NetR319_1: R319.1 U43.3(CAT)
NetR320_1: R320.1 U31.1(1DIR)
NetR321_1: R321.1 U31.24(2DIR)
NetR322_2: R322.2 U44.5(Vo) U45.5(3A)
NetR323_1: R323.1 U44.3(CAT)
NetR324_2: R324.2 U45.9(4A) U46.5(Vo)
NetR325_1: R325.1 U46.3(CAT)
NetR326_2: R326.2 U45.11(5A) U47.5(Vo)
NetR327_1: R327.1 U47.3(CAT)
NetR328_2: R328.2 U45.13(6A) U48.5(Vo)
NetR330_1: R330.1 U48.3(CAT)
NetU31_2: U31.2(1B1) U42.1(Anode)
NetU31_3: U31.3(1B2) U43.1(Anode)
NetU31_5: U31.5(1B3) U44.1(Anode)
NetU31_6: U31.6(1B4) U46.1(Anode)
NetU31_8: U31.8(1B5) U47.1(Anode)
NetU31_9: U31.9(1B6) U48.1(Anode)

Not connected (* = marked no-connect by the designer): U31 11(1B7)* 12(1B8)* 37(1A8)* 38(1A7)*; U42 2(NC)*; U43 2(NC)*; U44 2(NC)*; U46 2(NC)*; U47 2(NC)*; U48 2(NC)*; U52 13(4~{Z})* 14(4Y)* 15(4A)*; U53 13(4~{Z})* 14(4Y)* 15(4A)*

### Library data of the parts
C174-C187 C193 C201 C203 C206 C207 = Cap: Capacitor; Published: 8-Jun-2000; LatestRevisionDate: 17-Jul-2002; LatestRevisionNote: Re-released for DXP Platform.; PackageReference: RAD-0.3; Publisher: Altium Limited; PackageDescription: Radial Cap, Thru-Hole; 2 Leads; 0.3 in Pin Spacing
R316-R328 R330 = Res1: Resistor; Published: 8-Jun-2000; LatestRevisionDate: 17-Jul-2002; LatestRevisionNote: Re-released for DXP Platform.; PackageReference: AXIAL-0.3; Publisher: Altium Limited; PackageDescription: Axial Device, Thru-Hole; 2 Leads; 0.3 in Pin Spacing
U31 = SN74LVC16T245_A
U45 = CD74HC14: as U32 on sheet PWM_PULSE; Datasheet_URL: http://www.ti.com/lit/gpn/CD74HC14; GENERIC_PART_NUMBER: CD74HC14; Value: Value; Type: Type; RefDes: RefDes
U52 U53 = AM26LS31CD: Quadruple Differential Line Driver; Published: 15-May-2002; LatestRevisionDate: 13-Apr-2006; LatestRevisionNote: IPC-7351 Footprint Added.; DatasheetVersion: May-1990; PackageVersion: Jan-1998; PackageReference: D016; Publisher: Altium Limited; PackageDescription: 16-Pin Small Outline Integrated Circuit 1.27 mm Pitch; Code_IPC: SOIC127P600-16; ComponentLink1Description: Manufacturer Link; ComponentLink1URL: http://www.ti.com/; ComponentLink2Description: Datasheet; ComponentLink2URL: http://www-s.ti.com/sc/ds/am26ls31.pdf

## Nets that join several sheets
+3.3V: ADC (R18.2 R39.2), Communication_Part1 (6 pins), Communication_Part2 (R163.1 R165.1), DAC (C3.2 L1.1), DSP_GPIO_Part1 (8 pins), DSP_GPIO_Part2 (8 pins), DSP_GPIO_Part3 (8 pins), DSP_GPIO_Part4 (8 pins), Enconder_Part1 (C69.2 C78.2 U6.16 U8.16), Enconder_Part2 (C87.2 C96.2 U10.16 U12.16), Enconder_Part3 (C105.2 C114.2 U14.16 U16.16), FPGA_GPIO_Part1 (R279.1 R282.1 R285.1 R288.1), Power (9 pins), PWM_WIDTH (8 pins)
+5V: Communication_Part1 (8 pins), DAC (C16.2 L3.1), DSP_GPIO_Part1 (R167.2 R168.2 R169.2 R170.2), DSP_GPIO_Part2 (R195.2 R196.2 R197.2 R198.2), DSP_GPIO_Part3 (R223.2 R224.2 R225.2 R226.2), DSP_GPIO_Part4 (R251.2 R252.2 R253.2 R254.2), Enconder_Part1 (22 pins), Enconder_Part2 (22 pins), Enconder_Part3 (22 pins), Header (6 pins), Power (8 pins), PWM_PULSE (28 pins), PWM_WIDTH (34 pins)
AGND: DAC (39 pins), Header (8 pins), Power (8 pins)
DGND: ADC (30 pins), Communication_Part1 (32 pins), Communication_Part2 (12 pins), DAC (17 pins), DSP_GPIO_Part1 (R173.2 R176.2 R179.2 R182.2), DSP_GPIO_Part2 (R201.2 R204.2 R207.2 R210.2), DSP_GPIO_Part3 (R229.2 R232.2 R235.2 R238.2), DSP_GPIO_Part4 (R257.2 R260.2 R263.2 R266.2), Enconder_Part1 (32 pins), Enconder_Part2 (32 pins), Enconder_Part3 (32 pins), Header (14 pins), Interface_DSP_FPGA (6 pins), Power (20 pins), PWM_PULSE (36 pins), PWM_WIDTH (38 pins)
REF: DAC (C2.2 C15.2 U2.6 U2.43), Power (C158.2 R296.1 R297.1)
+12V: DAC (8 pins), Power (8 pins)
-12V: DAC (8 pins), Power (6 pins)
A0: DAC (U2.20), Interface_DSP_FPGA (P13.25)
A1: DAC (U2.21), Interface_DSP_FPGA (P13.26)
A2: DAC (U2.26), Interface_DSP_FPGA (P13.23)
A3: DAC (U2.27), Interface_DSP_FPGA (P13.24)
A4: DAC (U2.29), Interface_DSP_FPGA (P13.21)
CAN_N: Communication_Part1 (R160.1), Communication_Part2 (U20.25), Interface_DSP_FPGA (P14.4)
CAN_P: Communication_Part1 (R158.1), Communication_Part2 (U20.26), Interface_DSP_FPGA (P14.2)
D0: DAC (U2.46), Interface_DSP_FPGA (P13.20)
D1: DAC (U2.47), Interface_DSP_FPGA (P13.17)
D2: DAC (U2.48), Interface_DSP_FPGA (P13.18)
D3: DAC (U2.49), Interface_DSP_FPGA (P13.15)
D4: DAC (U2.50), Interface_DSP_FPGA (P13.16)
D5: DAC (U2.51), Interface_DSP_FPGA (P13.13)
D6: DAC (U2.52), Interface_DSP_FPGA (P13.14)
D7: DAC (U2.59), Interface_DSP_FPGA (P13.9)
D8: DAC (U2.60), Interface_DSP_FPGA (P13.10)
D9: DAC (U2.61), Interface_DSP_FPGA (P13.7)
D10: DAC (U2.62), Interface_DSP_FPGA (P13.8)
D11: DAC (U2.63), Interface_DSP_FPGA (P13.5)
D12: DAC (U2.64), Interface_DSP_FPGA (P13.6)
D13: DAC (U2.1), Interface_DSP_FPGA (P13.3)
D14: DAC (U2.2), Interface_DSP_FPGA (P13.4)
D15: DAC (U2.3), Interface_DSP_FPGA (P13.1)
DAC_BUSY: DAC (R9.1 U2.16), Interface_DSP_FPGA (P13.29)
DAC_CLR: DAC (R5.2 U2.17), Interface_DSP_FPGA (P13.30)
DAC_CS: DAC (U2.58), Interface_DSP_FPGA (P13.12)
DAC_GPIO: DAC (U2.33), Interface_DSP_FPGA (P13.22)
DAC_LDAC: DAC (R10.1 U2.18), Interface_DSP_FPGA (P13.27)
DAC_OUT_1: DAC (R1.2 U1.1), Header (JP23.1)
DAC_OUT_2: DAC (R2.2 U1.7), Header (JP23.3)
DAC_OUT_3: DAC (R3.2 U1.8), Header (JP23.5)
DAC_OUT_4: DAC (R7.2 U1.14), Header (JP23.7)
DAC_OUT_5: DAC (R13.2 U3.1), Header (JP23.9)
DAC_OUT_6: DAC (R15.2 U3.7), Header (JP23.11)
DAC_OUT_7: DAC (R16.2 U3.8), Header (JP23.13)
DAC_OUT_8: DAC (R17.2 U3.14), Header (JP23.15)
DAC_R/W: DAC (U2.57), Interface_DSP_FPGA (P13.11)
DAC_RST: DAC (R8.2 U2.19), Interface_DSP_FPGA (P13.28)
DAC_RSTSEL: DAC (R11.1 U2.34), Interface_DSP_FPGA (P13.19)
DAC_USB/BTC: DAC (R12.1 U2.15), Interface_DSP_FPGA (P13.32)
DAC_Vmon: DAC (C21.1 U2.4), Interface_DSP_FPGA (P13.2)
DSP_ADC_01: ADC (R22.2), Interface_DSP_FPGA (P12.7)
DSP_ADC_02: ADC (R27.2), Interface_DSP_FPGA (P12.8)
DSP_ADC_03: ADC (R33.2), Interface_DSP_FPGA (P12.5)
DSP_ADC_04: ADC (R38.2), Interface_DSP_FPGA (P12.6)
DSP_ADC_05: ADC (R43.2), Interface_DSP_FPGA (P12.3)
DSP_ADC_06: ADC (R48.2), Interface_DSP_FPGA (P12.4)
DSP_ADC_07: ADC (R54.2), Interface_DSP_FPGA (P12.1)
DSP_ADC_08: ADC (R59.2), Interface_DSP_FPGA (P12.2)
DSP_GPIO_5V_IN1_1_G1: DSP_GPIO_Part1 (U23.1), Header (P17.1)
DSP_GPIO_5V_IN1_1_G2: DSP_GPIO_Part2 (U25.1), Header (P22.1)
DSP_GPIO_5V_IN1_1_G3: DSP_GPIO_Part3 (U27.1), Header (P26.1)
DSP_GPIO_5V_IN1_1_G4: DSP_GPIO_Part4 (U29.1), Header (P31.1)
DSP_GPIO_5V_IN1_2_G1: DSP_GPIO_Part1 (R185.2), Header (P17.2)
DSP_GPIO_5V_IN1_2_G2: DSP_GPIO_Part2 (R213.2), Header (P22.2)
DSP_GPIO_5V_IN1_2_G3: DSP_GPIO_Part3 (R241.2), Header (P26.2)
DSP_GPIO_5V_IN1_2_G4: DSP_GPIO_Part4 (R269.2), Header (P31.2)
DSP_GPIO_5V_IN2_1_G1: DSP_GPIO_Part1 (U23.3), Header (P17.3)
DSP_GPIO_5V_IN2_1_G2: DSP_GPIO_Part2 (U25.3), Header (P22.3)
DSP_GPIO_5V_IN2_1_G3: DSP_GPIO_Part3 (U27.3), Header (P26.3)
DSP_GPIO_5V_IN2_1_G4: DSP_GPIO_Part4 (U29.3), Header (P31.3)
DSP_GPIO_5V_IN2_2_G1: DSP_GPIO_Part1 (R188.2), Header (P17.4)
DSP_GPIO_5V_IN2_2_G2: DSP_GPIO_Part2 (R216.2), Header (P22.4)
DSP_GPIO_5V_IN2_2_G3: DSP_GPIO_Part3 (R244.2), Header (P26.4)
DSP_GPIO_5V_IN2_2_G4: DSP_GPIO_Part4 (R272.2), Header (P31.4)
DSP_GPIO_5V_IN3_1_G1: DSP_GPIO_Part1 (U23.5), Header (P17.5)
DSP_GPIO_5V_IN3_1_G2: DSP_GPIO_Part2 (U25.5), Header (P22.5)
DSP_GPIO_5V_IN3_1_G3: DSP_GPIO_Part3 (U27.5), Header (P26.5)
DSP_GPIO_5V_IN3_1_G4: DSP_GPIO_Part4 (U29.5), Header (P31.5)
DSP_GPIO_5V_IN3_2_G1: DSP_GPIO_Part1 (R191.2), Header (P17.6)
DSP_GPIO_5V_IN3_2_G2: DSP_GPIO_Part2 (R219.2), Header (P22.6)
DSP_GPIO_5V_IN3_2_G3: DSP_GPIO_Part3 (R247.2), Header (P26.6)
DSP_GPIO_5V_IN3_2_G4: DSP_GPIO_Part4 (R275.2), Header (P31.6)
DSP_GPIO_5V_IN4_1_G1: DSP_GPIO_Part1 (U23.7), Header (P17.7)
DSP_GPIO_5V_IN4_1_G2: DSP_GPIO_Part2 (U25.7), Header (P22.7)
DSP_GPIO_5V_IN4_1_G3: DSP_GPIO_Part3 (U27.7), Header (P26.7)
DSP_GPIO_5V_IN4_1_G4: DSP_GPIO_Part4 (U29.7), Header (P31.7)
DSP_GPIO_5V_IN4_2_G1: DSP_GPIO_Part1 (R194.2), Header (P17.8)
DSP_GPIO_5V_IN4_2_G2: DSP_GPIO_Part2 (R222.2), Header (P22.8)
DSP_GPIO_5V_IN4_2_G3: DSP_GPIO_Part3 (R250.2), Header (P26.8)
DSP_GPIO_5V_IN4_2_G4: DSP_GPIO_Part4 (R278.2), Header (P31.8)
DSP_GPIO_5V_OUT1_G1: DSP_GPIO_Part1 (R172.2), Header (JP7.4)
DSP_GPIO_5V_OUT1_G2: DSP_GPIO_Part2 (R200.2), Header (JP8.4)
DSP_GPIO_5V_OUT1_G3: DSP_GPIO_Part3 (R228.2), Header (JP9.4)
DSP_GPIO_5V_OUT1_G4: DSP_GPIO_Part4 (R256.2), Header (JP10.4)
DSP_GPIO_5V_OUT2_G1: DSP_GPIO_Part1 (R175.2), Header (JP7.3)
DSP_GPIO_5V_OUT2_G2: DSP_GPIO_Part2 (R203.2), Header (JP8.3)
DSP_GPIO_5V_OUT2_G3: DSP_GPIO_Part3 (R231.2), Header (JP9.3)
DSP_GPIO_5V_OUT2_G4: DSP_GPIO_Part4 (R259.2), Header (JP10.3)
DSP_GPIO_5V_OUT3_G1: DSP_GPIO_Part1 (R178.2), Header (JP7.2)
DSP_GPIO_5V_OUT3_G2: DSP_GPIO_Part2 (R206.2), Header (JP8.2)
DSP_GPIO_5V_OUT3_G3: DSP_GPIO_Part3 (R234.2), Header (JP9.2)
DSP_GPIO_5V_OUT3_G4: DSP_GPIO_Part4 (R262.2), Header (JP10.2)
DSP_GPIO_5V_OUT4_G1: DSP_GPIO_Part1 (R181.2), Header (JP7.1)
DSP_GPIO_5V_OUT4_G2: DSP_GPIO_Part2 (R209.2), Header (JP8.1)
DSP_GPIO_5V_OUT4_G3: DSP_GPIO_Part3 (R237.2), Header (JP9.1)
DSP_GPIO_5V_OUT4_G4: DSP_GPIO_Part4 (R265.2), Header (JP10.1)
DSP_GPIO_IN1_G1: DSP_GPIO_Part1 (R184.1), Interface_DSP_FPGA (P14.23)
DSP_GPIO_IN1_G2: DSP_GPIO_Part2 (R212.1), Interface_DSP_FPGA (P14.29)
DSP_GPIO_IN1_G3: DSP_GPIO_Part3 (R240.1), Interface_DSP_FPGA (P14.33)
DSP_GPIO_IN1_G4: DSP_GPIO_Part4 (R268.1), Interface_DSP_FPGA (P12.9)
DSP_GPIO_IN2_G1: DSP_GPIO_Part1 (R187.1), Interface_DSP_FPGA (P14.24)
DSP_GPIO_IN2_G2: DSP_GPIO_Part2 (R215.1), Interface_DSP_FPGA (P14.30)
DSP_GPIO_IN2_G3: DSP_GPIO_Part3 (R243.1), Interface_DSP_FPGA (P14.34)
DSP_GPIO_IN2_G4: DSP_GPIO_Part4 (R271.1), Interface_DSP_FPGA (P12.10)
DSP_GPIO_IN3_G1: DSP_GPIO_Part1 (R190.1), Interface_DSP_FPGA (P14.26)
DSP_GPIO_IN3_G2: DSP_GPIO_Part2 (R218.1), Interface_DSP_FPGA (P14.31)
DSP_GPIO_IN3_G3: DSP_GPIO_Part3 (R246.1), Interface_DSP_FPGA (P14.35)
DSP_GPIO_IN3_G4: DSP_GPIO_Part4 (R274.1), Interface_DSP_FPGA (P12.11)
DSP_GPIO_IN4_G1: DSP_GPIO_Part1 (R193.1), Interface_DSP_FPGA (P14.28)
DSP_GPIO_IN4_G2: DSP_GPIO_Part2 (R221.1), Interface_DSP_FPGA (P14.32)
DSP_GPIO_IN4_G3: DSP_GPIO_Part3 (R249.1), Interface_DSP_FPGA (P14.36)
DSP_GPIO_IN4_G4: DSP_GPIO_Part4 (R277.1), Interface_DSP_FPGA (P12.12)
DSP_GPIO_OUT1_G1: DSP_GPIO_Part1 (U22.2), Interface_DSP_FPGA (P14.10)
DSP_GPIO_OUT1_G2: DSP_GPIO_Part2 (U24.2), Interface_DSP_FPGA (P14.14)
DSP_GPIO_OUT1_G3: DSP_GPIO_Part3 (U26.2), Interface_DSP_FPGA (P14.18)
DSP_GPIO_OUT1_G4: DSP_GPIO_Part4 (U28.2), Interface_DSP_FPGA (P14.22)
DSP_GPIO_OUT2_G1: DSP_GPIO_Part1 (U22.4), Interface_DSP_FPGA (P14.9)
DSP_GPIO_OUT2_G2: DSP_GPIO_Part2 (U24.4), Interface_DSP_FPGA (P14.13)
DSP_GPIO_OUT2_G3: DSP_GPIO_Part3 (U26.4), Interface_DSP_FPGA (P14.17)
DSP_GPIO_OUT2_G4: DSP_GPIO_Part4 (U28.4), Interface_DSP_FPGA (P14.21)
DSP_GPIO_OUT3_G1: DSP_GPIO_Part1 (U22.6), Interface_DSP_FPGA (P14.8)
DSP_GPIO_OUT3_G2: DSP_GPIO_Part2 (U24.6), Interface_DSP_FPGA (P14.12)
DSP_GPIO_OUT3_G3: DSP_GPIO_Part3 (U26.6), Interface_DSP_FPGA (P14.16)
DSP_GPIO_OUT3_G4: DSP_GPIO_Part4 (U28.6), Interface_DSP_FPGA (P14.20)
DSP_GPIO_OUT4_G1: DSP_GPIO_Part1 (U22.8), Interface_DSP_FPGA (P14.7)
DSP_GPIO_OUT4_G2: DSP_GPIO_Part2 (U24.8), Interface_DSP_FPGA (P14.11)
DSP_GPIO_OUT4_G3: DSP_GPIO_Part3 (U26.8), Interface_DSP_FPGA (P14.15)
DSP_GPIO_OUT4_G4: DSP_GPIO_Part4 (U28.8), Interface_DSP_FPGA (P14.19)
DSP_RS485_EN: Communication_Part1 (R153.1), Interface_DSP_FPGA (P14.5)
DSP_RS485_RXD: Communication_Part1 (R151.1), Interface_DSP_FPGA (P14.1)
DSP_RS485_TXD: Communication_Part1 (R154.1), Interface_DSP_FPGA (P14.3)
Enconder01_A+: Enconder_Part1 (L11.1), Header (JP1.3)
Enconder01_A-: Enconder_Part1 (L11.2), Header (JP1.4)
Enconder01_B+: Enconder_Part1 (L12.1), Header (JP1.5)
Enconder01_B-: Enconder_Part1 (L12.2), Header (JP1.6)
Enconder01_Z+: Enconder_Part1 (L13.1), Header (JP1.7)
Enconder01_Z-: Enconder_Part1 (L13.2), Header (JP1.8)
Enconder02_A+: Enconder_Part1 (L14.1), Header (JP2.3)
Enconder02_A-: Enconder_Part1 (L14.2), Header (JP2.4)
Enconder02_B+: Enconder_Part1 (L15.1), Header (JP2.5)
Enconder02_B-: Enconder_Part1 (L15.2), Header (JP2.6)
Enconder02_Z+: Enconder_Part1 (L16.1), Header (JP2.7)
Enconder02_Z-: Enconder_Part1 (L16.2), Header (JP2.8)
Enconder03_A+: Enconder_Part2 (L17.1), Header (JP3.3)
Enconder03_A-: Enconder_Part2 (L17.2), Header (JP3.4)
Enconder03_B+: Enconder_Part2 (L18.1), Header (JP3.5)
Enconder03_B-: Enconder_Part2 (L18.2), Header (JP3.6)
Enconder03_Z+: Enconder_Part2 (L19.1), Header (JP3.7)
Enconder03_Z-: Enconder_Part2 (L19.2), Header (JP3.8)
Enconder04_A+: Enconder_Part2 (L20.1), Header (JP4.3)
Enconder04_A-: Enconder_Part2 (L20.2), Header (JP4.4)
Enconder04_B+: Enconder_Part2 (L21.1), Header (JP4.5)
Enconder04_B-: Enconder_Part2 (L21.2), Header (JP4.6)
Enconder04_Z+: Enconder_Part2 (L22.1), Header (JP4.7)
Enconder04_Z-: Enconder_Part2 (L22.2), Header (JP4.8)
Enconder05_A+: Enconder_Part3 (L23.1), Header (JP5.3)
Enconder05_A-: Enconder_Part3 (L23.2), Header (JP5.4)
Enconder05_B+: Enconder_Part3 (L24.1), Header (JP5.5)
Enconder05_B-: Enconder_Part3 (L24.2), Header (JP5.6)
Enconder05_Z+: Enconder_Part3 (L25.1), Header (JP5.7)
Enconder05_Z-: Enconder_Part3 (L25.2), Header (JP5.8)
Enconder06_A+: Enconder_Part3 (L26.1), Header (JP6.3)
Enconder06_A-: Enconder_Part3 (L26.2), Header (JP6.4)
Enconder06_B+: Enconder_Part3 (L27.1), Header (JP6.5)
Enconder06_B-: Enconder_Part3 (L27.2), Header (JP6.6)
Enconder06_Z+: Enconder_Part3 (L28.1), Header (JP6.7)
Enconder06_Z-: Enconder_Part3 (L28.2), Header (JP6.8)
F_Enconder01_A: Enconder_Part1 (U6.14), Interface_DSP_FPGA (P13.42)
F_Enconder01_B: Enconder_Part1 (U6.13), Interface_DSP_FPGA (P13.41)
F_Enconder01_Z: Enconder_Part1 (U6.12), Interface_DSP_FPGA (P13.44)
F_Enconder02_A: Enconder_Part1 (U8.14), Interface_DSP_FPGA (P13.37)
F_Enconder02_B: Enconder_Part1 (U8.13), Interface_DSP_FPGA (P13.40)
F_Enconder02_Z: Enconder_Part1 (U8.12), Interface_DSP_FPGA (P13.39)
F_Enconder03_A: Enconder_Part2 (U10.14), Interface_DSP_FPGA (P13.49)
F_Enconder03_B: Enconder_Part2 (U10.13), Interface_DSP_FPGA (P13.52)
F_Enconder03_Z: Enconder_Part2 (U10.12), Interface_DSP_FPGA (P13.51)
F_Enconder04_A: Enconder_Part2 (U12.14), Interface_DSP_FPGA (P13.54)
F_Enconder04_B: Enconder_Part2 (U12.13), Interface_DSP_FPGA (P13.53)
F_Enconder04_Z: Enconder_Part2 (U12.12), Interface_DSP_FPGA (P13.55)
F_Enconder05_A: Enconder_Part3 (U14.14), Interface_DSP_FPGA (P13.43)
F_Enconder05_B: Enconder_Part3 (U14.13), Interface_DSP_FPGA (P13.46)
F_Enconder05_Z: Enconder_Part3 (U14.12), Interface_DSP_FPGA (P13.45)
F_Enconder06_A: Enconder_Part3 (U16.14), Interface_DSP_FPGA (P13.48)
F_Enconder06_B: Enconder_Part3 (U16.13), Interface_DSP_FPGA (P13.47)
F_Enconder06_Z: Enconder_Part3 (U16.12), Interface_DSP_FPGA (P13.50)
FPGA_GPIO_5V_IN1_1_G1: FPGA_GPIO_Part1 (U30.1), Header (P33.1)
FPGA_GPIO_5V_IN1_2_G1: FPGA_GPIO_Part1 (R281.2), Header (P33.2)
FPGA_GPIO_5V_IN2_1_G1: FPGA_GPIO_Part1 (U30.3), Header (P33.3)
FPGA_GPIO_5V_IN2_2_G1: FPGA_GPIO_Part1 (R284.2), Header (P33.4)
FPGA_GPIO_5V_IN3_1_G1: FPGA_GPIO_Part1 (U30.5), Header (P33.5)
FPGA_GPIO_5V_IN3_2_G1: FPGA_GPIO_Part1 (R287.2), Header (P33.6)
FPGA_GPIO_5V_IN4_1_G1: FPGA_GPIO_Part1 (U30.7), Header (P33.7)
FPGA_GPIO_5V_IN4_2_G1: FPGA_GPIO_Part1 (R290.2), Header (P33.8)
FPGA_GPIO_IN1: FPGA_GPIO_Part1 (R280.1), Interface_DSP_FPGA (P13.33)
FPGA_GPIO_IN2: FPGA_GPIO_Part1 (R283.1), Interface_DSP_FPGA (P13.36)
FPGA_GPIO_IN3: FPGA_GPIO_Part1 (R286.1), Interface_DSP_FPGA (P13.35)
FPGA_GPIO_IN4: FPGA_GPIO_Part1 (R289.1), Interface_DSP_FPGA (P13.38)
FPGA_Uart_RXD: Communication_Part2 (U21.25), Interface_DSP_FPGA (P13.34)
FPGA_Uart_TXD: Communication_Part2 (U21.26), Interface_DSP_FPGA (P13.31)
PWM_PULSE_1: Interface_DSP_FPGA (P11.6), PWM_PULSE (U31.36)
PWM_PULSE_1+: Header (JP25.1), PWM_PULSE (U51.2)
PWM_PULSE_1-: Header (JP25.2), PWM_PULSE (U51.3)
PWM_PULSE_2: Interface_DSP_FPGA (P11.5), PWM_PULSE (U31.35)
PWM_PULSE_2+: Header (JP25.3), PWM_PULSE (U51.6)
PWM_PULSE_2-: Header (JP25.4), PWM_PULSE (U51.5)
PWM_PULSE_3: Interface_DSP_FPGA (P11.4), PWM_PULSE (U31.33)
PWM_PULSE_3+: Header (JP25.5), PWM_PULSE (U51.10)
PWM_PULSE_3-: Header (JP25.6), PWM_PULSE (U51.11)
PWM_PULSE_4: Interface_DSP_FPGA (P11.3), PWM_PULSE (U31.32)
PWM_PULSE_4+: Header (JP26.1), PWM_PULSE (U50.2)
PWM_PULSE_4-: Header (JP26.2), PWM_PULSE (U50.3)
PWM_PULSE_5: Interface_DSP_FPGA (P11.2), PWM_PULSE (U31.30)
PWM_PULSE_5+: Header (JP26.3), PWM_PULSE (U50.6)
PWM_PULSE_5-: Header (JP26.4), PWM_PULSE (U50.5)
PWM_PULSE_6: Interface_DSP_FPGA (P11.1), PWM_PULSE (U31.29)
PWM_PULSE_6+: Header (JP26.5), PWM_PULSE (U50.10)
PWM_PULSE_6-: Header (JP26.6), PWM_PULSE (U50.11)
PWM_WIDTH_1: Interface_DSP_FPGA (P11.12), PWM_WIDTH (U31.47)
PWM_WIDTH_1+: Header (JP13.1), PWM_WIDTH (U52.2)
PWM_WIDTH_1-: Header (JP13.2), PWM_WIDTH (U52.3)
PWM_WIDTH_2: Interface_DSP_FPGA (P11.11), PWM_WIDTH (U31.46)
PWM_WIDTH_2+: Header (JP13.3), PWM_WIDTH (U52.6)
PWM_WIDTH_2-: Header (JP13.4), PWM_WIDTH (U52.5)
PWM_WIDTH_3: Interface_DSP_FPGA (P11.10), PWM_WIDTH (U31.44)
PWM_WIDTH_3+: Header (JP13.5), PWM_WIDTH (U52.10)
PWM_WIDTH_3-: Header (JP13.6), PWM_WIDTH (U52.11)
PWM_WIDTH_4: Interface_DSP_FPGA (P11.9), PWM_WIDTH (U31.43)
PWM_WIDTH_4+: Header (JP14.1), PWM_WIDTH (U53.2)
PWM_WIDTH_4-: Header (JP14.2), PWM_WIDTH (U53.3)
PWM_WIDTH_5: Interface_DSP_FPGA (P11.8), PWM_WIDTH (U31.41)
PWM_WIDTH_5+: Header (JP14.3), PWM_WIDTH (U53.6)
PWM_WIDTH_5-: Header (JP14.4), PWM_WIDTH (U53.5)
PWM_WIDTH_6: Interface_DSP_FPGA (P11.7), PWM_WIDTH (U31.40)
PWM_WIDTH_6+: Header (JP14.5), PWM_WIDTH (U53.10)
PWM_WIDTH_6-: Header (JP14.6), PWM_WIDTH (U53.11)